# Altium project EPS.PrjPcb (part 1 of 4)
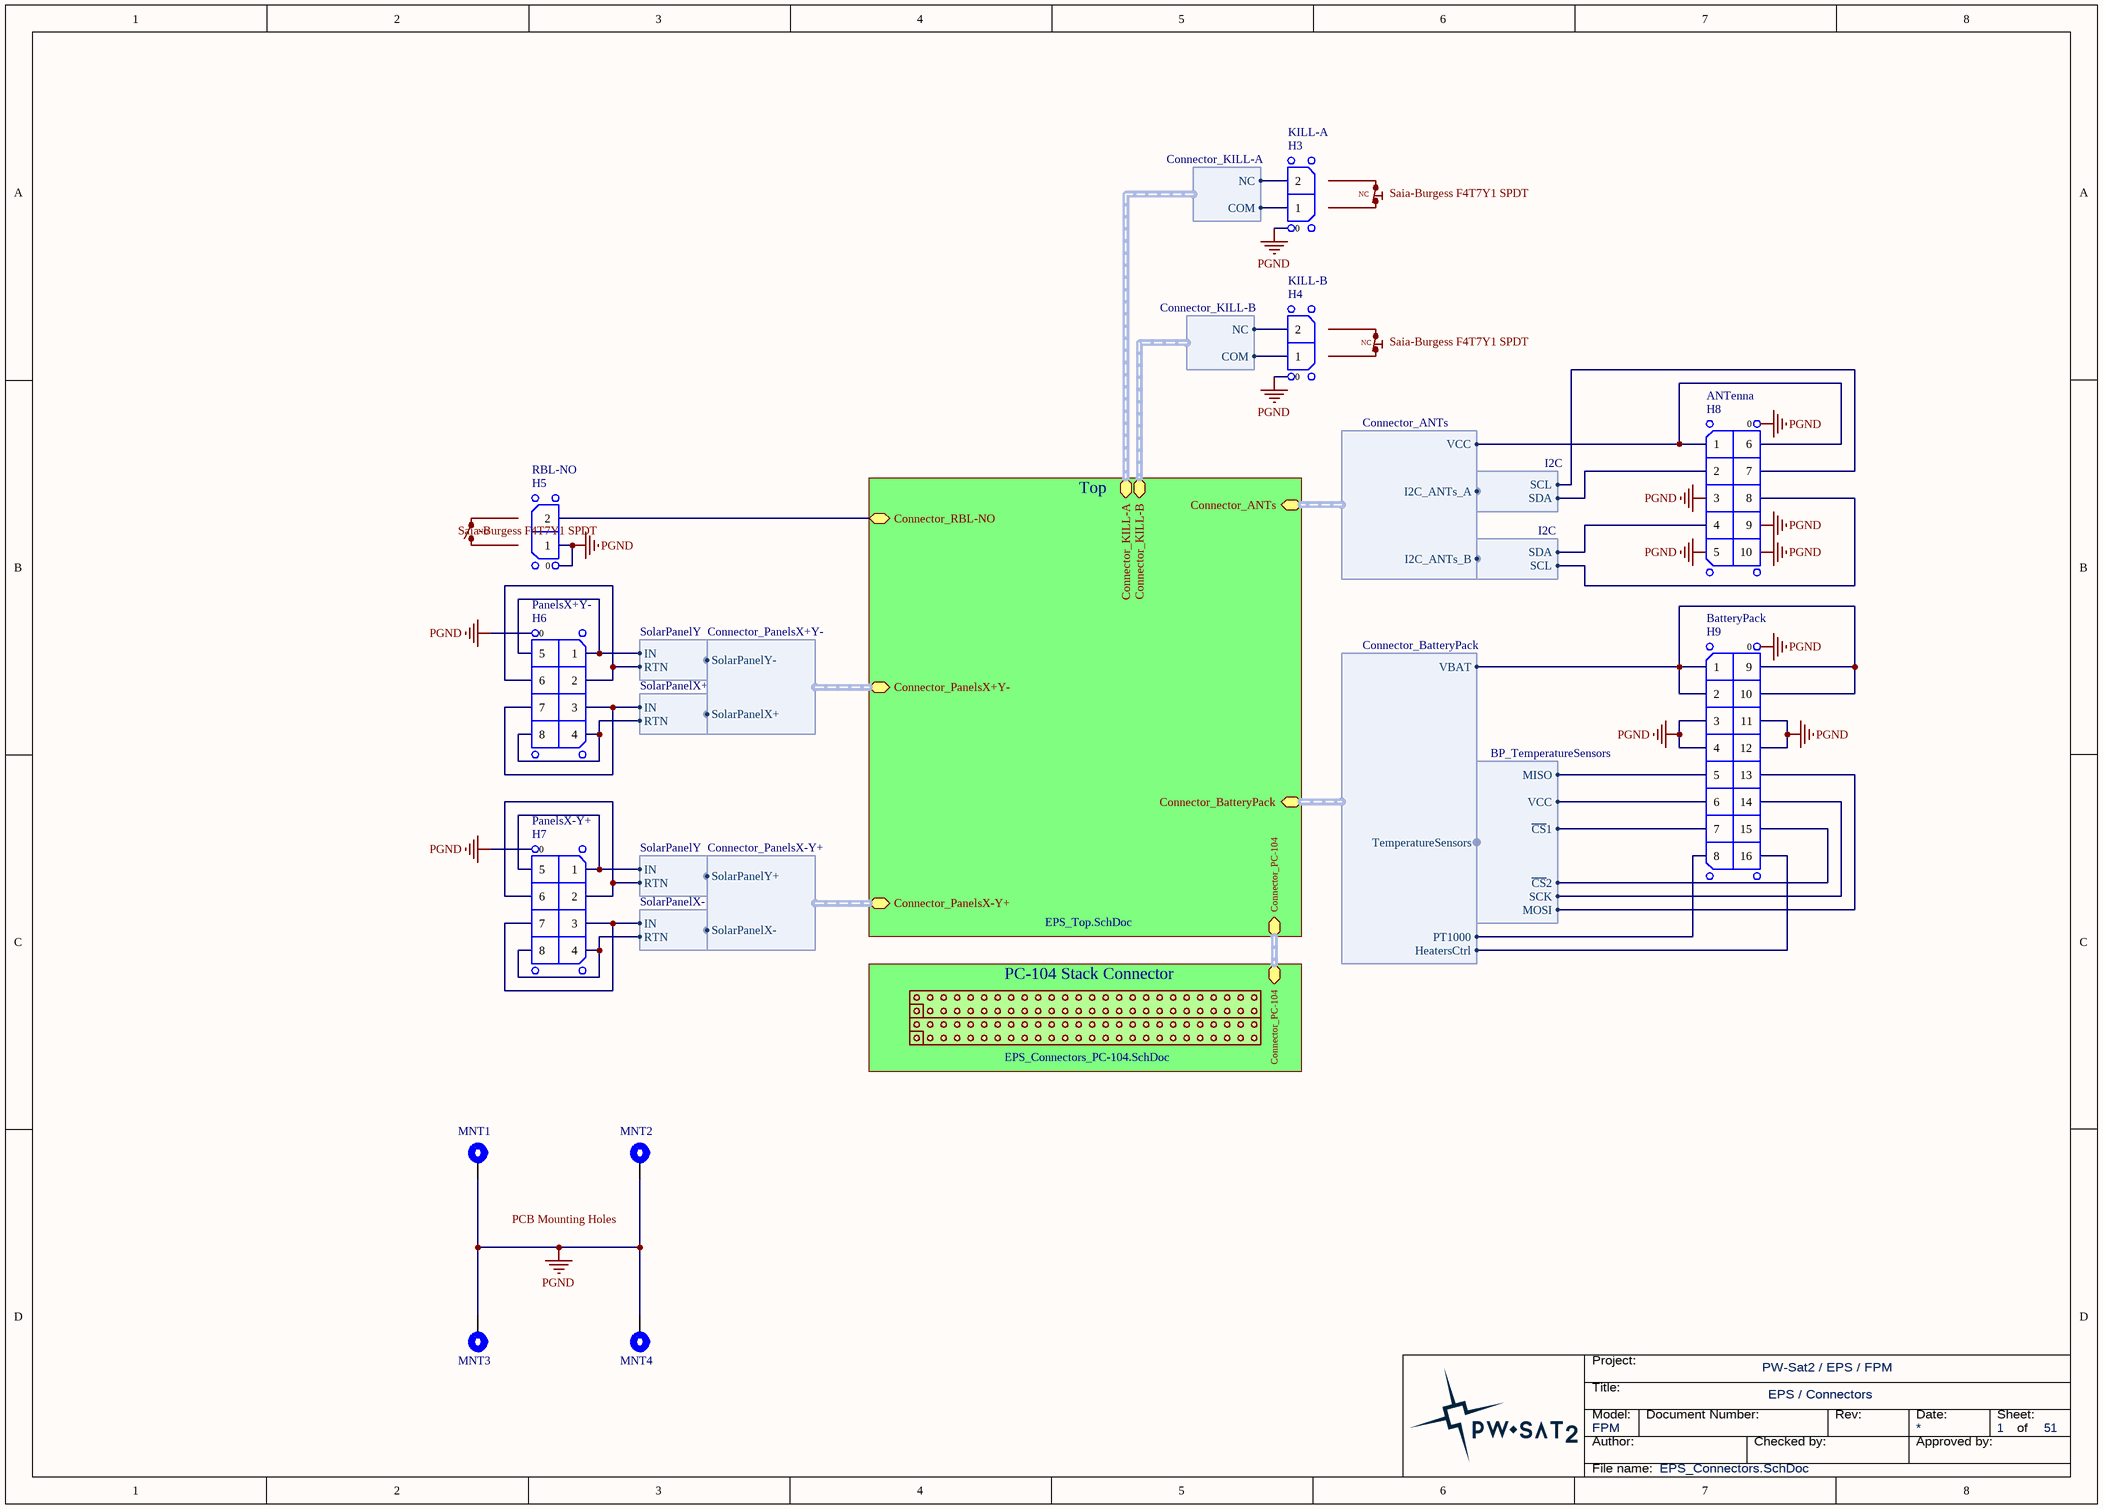
[diagram p0: EPS_Connectors.SchDoc]
ApprovedBy_Name: (not approved); Author_Name: Piotr Kuligowski; CheckedBy_Name: (not checked); Equipment: EPS; Model: FPM; PCB_Author: (pcbdoc author); PCB_CheckedBy: (not checked); PCB_DocName: EPS; PCB_DocNo: PWSat2-xxx-DW-xxx; PCB_Revision: 3; Project_FullName: PW-Sat2; Project_ShortName: PW-Sat2; Schematics_DocName: EPS; Schematics_DocNo: PWSat2-xxx-DW-xxx; Schematics_Revision: 3
40 sheets, 821 parts. Net scope: hierarchical (ports join the sheet entries above them; power ports are global).
Board file: EPS.PcbDoc
Sheets:
  EPS_Connectors.SchDoc
    Top = EPS_Top.SchDoc
      Controller A = EPS_CTRL_A.SchDoc
        I2C Repeater = EPS_I2C-Repeater.SchDoc
        CTRL-A_Supply = EPS_CTRL_AB_Supply.SchDoc
        Temperature-Sensor = EPS_Temperature-Sensor.SchDoc
      MPPT X = EPS_MPPT_X.SchDoc
        MPPTX Boost Converter = EPS_MPPT_X_Boost-Converter.SchDoc
        MPPTX Interface to uC = EPS_MPPT_XY_Interface.SchDoc
        MPPTX Measurements = EPS_MPPT_XY_Measurements.SchDoc
        MPPTX Input EMI Filter = EPS_MPPT_X_EMI-Filter_In.SchDoc
        MPPTX ORing to MPB = EPS_MPPT_X_OR_MPB.SchDoc
      MPPT Y+ = EPS_MPPT_Y.SchDoc
        MPPTY Buck-Boost Converter = EPS_MPPT_Y_Buck-Boost-Converter.SchDoc
        MPPTY EMI Filters for Solar Panels = EPS_MPPT_Y_EMI-Filter_Solar-Panels.SchDoc
        MPPTY Interface to uC = EPS_MPPT_XY_Interface.SchDoc
        MPPTY Measurements = EPS_MPPT_XY_Measurements.SchDoc
        MPPTY Input EMI Filter = EPS_MPPT_Y_EMI-Filter_In.SchDoc
        MPPTY Output EMI Filter = EPS_MPPT_Y_EMI-Filter_Out.SchDoc
        MPPTY ORing to MPB = EPS_MPPT_Y_OR_MPB.SchDoc
      3V3 = EPS_3V3.SchDoc
        Temperature-Sensor = EPS_Temperature-Sensor.SchDoc
      5V = EPS_5V.SchDoc
        5V Output EMI Fitler = EPS_5V_EMI-Filter_Out.SchDoc
        Temperature-Sensor = EPS_Temperature-Sensor.SchDoc
      RBL & Inrush Limit = EPS_RBL.SchDoc
      Distribution = EPS_Distribution.SchDoc
        LCL-FPF SunS 3V3 = EPS_Distribution_LCL-FPF.SchDoc
        LCL-FPF CAMnadir 3V3 = EPS_Distribution_LCL-FPF.SchDoc
        LCL-FPF CAMwing 3V3 = EPS_Distribution_LCL-FPF.SchDoc
        LCL-TK MAIN = EPS_Distribution_LCL-TK.SchDoc
        LCL-TK Redundant = EPS_Distribution_LCL-TK.SchDoc
        LCL-FPF SENS 5V = EPS_Distribution_LCL-FPF.SchDoc
        RLCL-FPF 5V = EPS_Distribution_RLCL-FPF.SchDoc
        5V Measurements = EPS_Distribution_Measurements.SchDoc
        3V3 Measurements = EPS_Distribution_Measurements.SchDoc
        VBAT Measurements = EPS_Distribution_Measurements.SchDoc
        LCL-FPF ANTs 5V = EPS_Distribution_LCL-FPF.SchDoc
        RLCL-FPF 3V3 = EPS_Distribution_RLCL-FPF.SchDoc
        LCL-FPF ANTs 5V = EPS_Distribution_LCL-FPF.SchDoc
      VBAT = EPS_VBAT.SchDoc
      LCLs for DCDC = EPS_DCDC_RLCLs.SchDoc
        DCDC RLCL = EPS_DCDC_RLCL-FPF.SchDoc
        VBAT RLCL = EPS_DCDC_RLCL-FPF.SchDoc
      Local-Supply and WDTs = EPS_Local-Supply.SchDoc
        Local-Supply CTRL-A = EPS_Local-Supply_Channel.SchDoc
          Temperature-Sensor = EPS_Temperature-Sensor.SchDoc
        Local-Supply CTRL-B = EPS_Local-Supply_Channel.SchDoc
          Temperature-Sensor = EPS_Temperature-Sensor.SchDoc
      Battery Pack = EPS_Battery.SchDoc
        Battery Controller = EPS_Battery_Controller.SchDoc
          Battery Current Meas. = EPS_Battery_Controller_Current-Meas.SchDoc
          Battery Voltage Meas. = EPS_Battery_Controller_Voltage-Meas.SchDoc
          Battery Charger - RLCL = EPS_Battery_Controller_RLCL.SchDoc
        Heaters Control = EPS_Battery_Heaters-Control.SchDoc
        Temperature-Sensor = EPS_Temperature-Sensor.SchDoc
      MPPT Y- = EPS_MPPT_Y.SchDoc
        MPPTY Buck-Boost Converter = EPS_MPPT_Y_Buck-Boost-Converter.SchDoc
        MPPTY EMI Filters for Solar Panels = EPS_MPPT_Y_EMI-Filter_Solar-Panels.SchDoc
        MPPTY Interface to uC = EPS_MPPT_XY_Interface.SchDoc
        MPPTY Measurements = EPS_MPPT_XY_Measurements.SchDoc
        MPPTY Input EMI Filter = EPS_MPPT_Y_EMI-Filter_In.SchDoc
        MPPTY Output EMI Filter = EPS_MPPT_Y_EMI-Filter_Out.SchDoc
        MPPTY ORing to MPB = EPS_MPPT_Y_OR_MPB.SchDoc
      Controller B = EPS_CTRL_B.SchDoc
        I2C Repeater = EPS_I2C-Repeater.SchDoc
        Temperature-Sensor = EPS_Temperature-Sensor.SchDoc
        CTRL-B_Supply = EPS_CTRL_AB_Supply.SchDoc
    PC-104 Stack Connector = EPS_Connectors_PC-104.SchDoc

## Sheet EPS_Connectors.SchDoc: Connectors
size A3; ApprovedBy: (not approved); CheckedBy: (not checked); Author: Piotr Kuligowski; DocumentNumber: PWSat2-xxx-DW-xxx; Revision: 3; SheetNumber: 1; SheetTotal: 51; Model: FPM

### Parts
H3  KILL-A  [Harwin_Datamate_L-Tek_M80-8770222]
H4  KILL-B  [Harwin_Datamate_L-Tek_M80-8770222]
H5  RBL-NO  [Harwin_Datamate_L-Tek_M80-8770222]
H6  PanelsX+Y-  [Harwin_Datamate_L-Tek_M80-8670805]
H7  PanelsX-Y+  [Harwin_Datamate_L-Tek_M80-8670805]
H8  ANTenna  [Harwin_Datamate_L-Tek_M80-8671005]
H9  BatteryPack  [Harwin_Datamate_L-Tek_M80-8531642]
MNT1  Mounting Hole  [PC-104_PcbMntHole_M3]  (value not drawn)
MNT2  Mounting Hole  [PC-104_PcbMntHole_M3]  (value not drawn)
MNT3  Mounting Hole  [PC-104_PcbMntHole_M3]  (value not drawn)
MNT4  Mounting Hole  [PC-104_PcbMntHole_M3]  (value not drawn)

### Sub-sheets
PC-104 Stack Connector = EPS_Connectors_PC-104.SchDoc: Connector_PC-104 (harness Connector_PC-104)
Top = EPS_Top.SchDoc: Connector_PC-104 (harness Connector_PC-104), Connector_KILL-B (harness Connector_KILL-B), Connector_KILL-A (harness Connector_KILL-A), Connector_PanelsX+Y- (harness Connector_PanelsX+Y-), Connector_PanelsX-Y+ (harness Connector_PanelsX-Y+), Connector_ANTs (harness Connector_ANTs), Connector_BatteryPack (harness Connector_BatteryPack), Connector_RBL-NO (bidir)

### Harnesses
SolarPanelX-: IN, RTN
SolarPanelY: IN, RTN
SolarPanelX+: IN, RTN
Connector_PanelsX-Y+: SolarPanelX-, SolarPanelY+
Connector_PanelsX+Y-: SolarPanelX+, SolarPanelY-
Connector_KILL-A: COM, NC
Connector_KILL-B: COM, NC
I2C: SDA, SCL
Connector_ANTs: I2C_ANTs_A, VCC, I2C_ANTs_B
Connector_BatteryPack: VBAT, TemperatureSensors, HeatersCtrl, PT1000
BP_TemperatureSensors: MISO, VCC, ~{CS}1, ~{CS}2, SCK, MOSI

### Nets
PGND: H3.0 H4.0 H5.0 H5.1 H6.0 H7.0 H8.0 H8.3 H8.5 H8.9 H8.10 H9.0 H9.3 H9.4 H9.11 H9.12 MNT1.1 MNT2.1 MNT3.1 MNT4.1
PC-104_I2C-Bus_SCL: H8.7 ; harness I2C.SCL
PC-104_I2C-Bus_SDA: H8.2 ; harness I2C.SDA
PC-104_I2C-Payload_SCL: H8.8 ; harness I2C.SCL
PC-104_I2C-Payload_SDA: H8.4 ; harness I2C.SDA
PC-104_Kill-Switch_Pri: H3.2 H4.2 ; sheet Top/Connector_KILL-A.NC, sheet Top/Connector_KILL-B.NC
PC-104_Kill-Switch_Sec: H3.1 H4.1 ; sheet Top/Connector_KILL-A.COM, sheet Top/Connector_KILL-B.COM
NetBATV_R1_1: H9.1 H9.2 H9.9 H9.10 ; sheet Top/Connector_BatteryPack.VBAT
NetCTRLA_J3_1: H9.6 ; harness BP_TemperatureSensors.VCC
NetCTRLA_R16_1: H9.7 ; harness BP_TemperatureSensors.~{CS}1
NetCTRLA_R16_2: H9.15 ; harness BP_TemperatureSensors.~{CS}2
NetCTRLA_R16_3: H9.5 ; harness BP_TemperatureSensors.MISO
NetCTRLA_R16_4: H9.13 ; harness BP_TemperatureSensors.MOSI
NetCTRLA_R17_2: H9.14 ; harness BP_TemperatureSensors.SCK
NetCTRLB_C5_1: H9.8 ; sheet Top/Connector_BatteryPack.PT1000
NetEMIYS_T1_1_1: H7.1 H7.5 ; harness SolarPanelY.IN
NetEMIYS_T1_1_2: H7.2 H7.6 ; harness SolarPanelY.RTN
NetEMIYS_T1_2_1: H6.1 H6.5 ; harness SolarPanelY.IN
NetEMIYS_T1_2_2: H6.2 H6.6 ; harness SolarPanelY.RTN
NetH5_2: H5.2 ; sheet Top/Connector_RBL-NO
NetH6_3: H6.3 H6.7 ; harness SolarPanelX+.IN
NetH6_4: H6.4 H6.8 ; harness SolarPanelX+.RTN
NetH7_3: H7.3 H7.7 ; harness SolarPanelX-.IN
NetH7_4: H7.4 H7.8 ; harness SolarPanelX-.RTN
NetH8_1: H8.1 H8.6 ; sheet Top/Connector_ANTs.VCC
NetH9_16: H9.16 ; sheet Top/Connector_BatteryPack.HeatersCtrl

### Buses and harness runs
harness sheet PC-104 Stack Connector/Connector_PC-104 = sheet Top/Connector_PC-104

### Notes on the sheet
- NC
- Saia-Burgess F4T7Y1 SPDT
- NO
- PCB Mounting Holes
- Title:
- Project:
- Author:
- Model:
- Document Number:
- Checked by:
- Rev:
- Date:
- Approved by:
- Sheet:
- of
- File name:

### Library data of the parts
H3-H5 = Harwin_Datamate_L-Tek_1x2pin: Harwin DataMate L-Tek, 2mm pitch, 1x2pin.; Value: Harwin DataMate L-Tek 1x2pin
H6 H7 = Harwin_Datamate_L-Tek_2x4pin: Harwin DataMate L-Tek, 2mm pitch, 2x4pin.; Value: Harwin DataMate L-Tek 2x4pin
H8 = Harwin_Datamate_L-Tek_2x5pin: Harwin DataMate L-Tek, 2mm pitch, 2x5pin.; Value: Harwin DataMate L-Tek 2x5pin
H9 = Harwin_Datamate_L-Tek_2x8pin: Harwin DataMate L-Tek, 2mm pitch, 2x8pin.; Value: Harwin DataMate L-Tek 2x8pin
MNT1-MNT4 = MntHole: PCB Mounting Hole; Value: Mounting Hole

## Sheet EPS_Top.SchDoc: Top
size A3; ApprovedBy: (not approved); CheckedBy: (not checked); Author: Piotr Kuligowski; DocumentNumber: PWSat2-xxx-DW-xxx; Revision: 3; SheetNumber: 3; SheetTotal: 51; Model: FPM
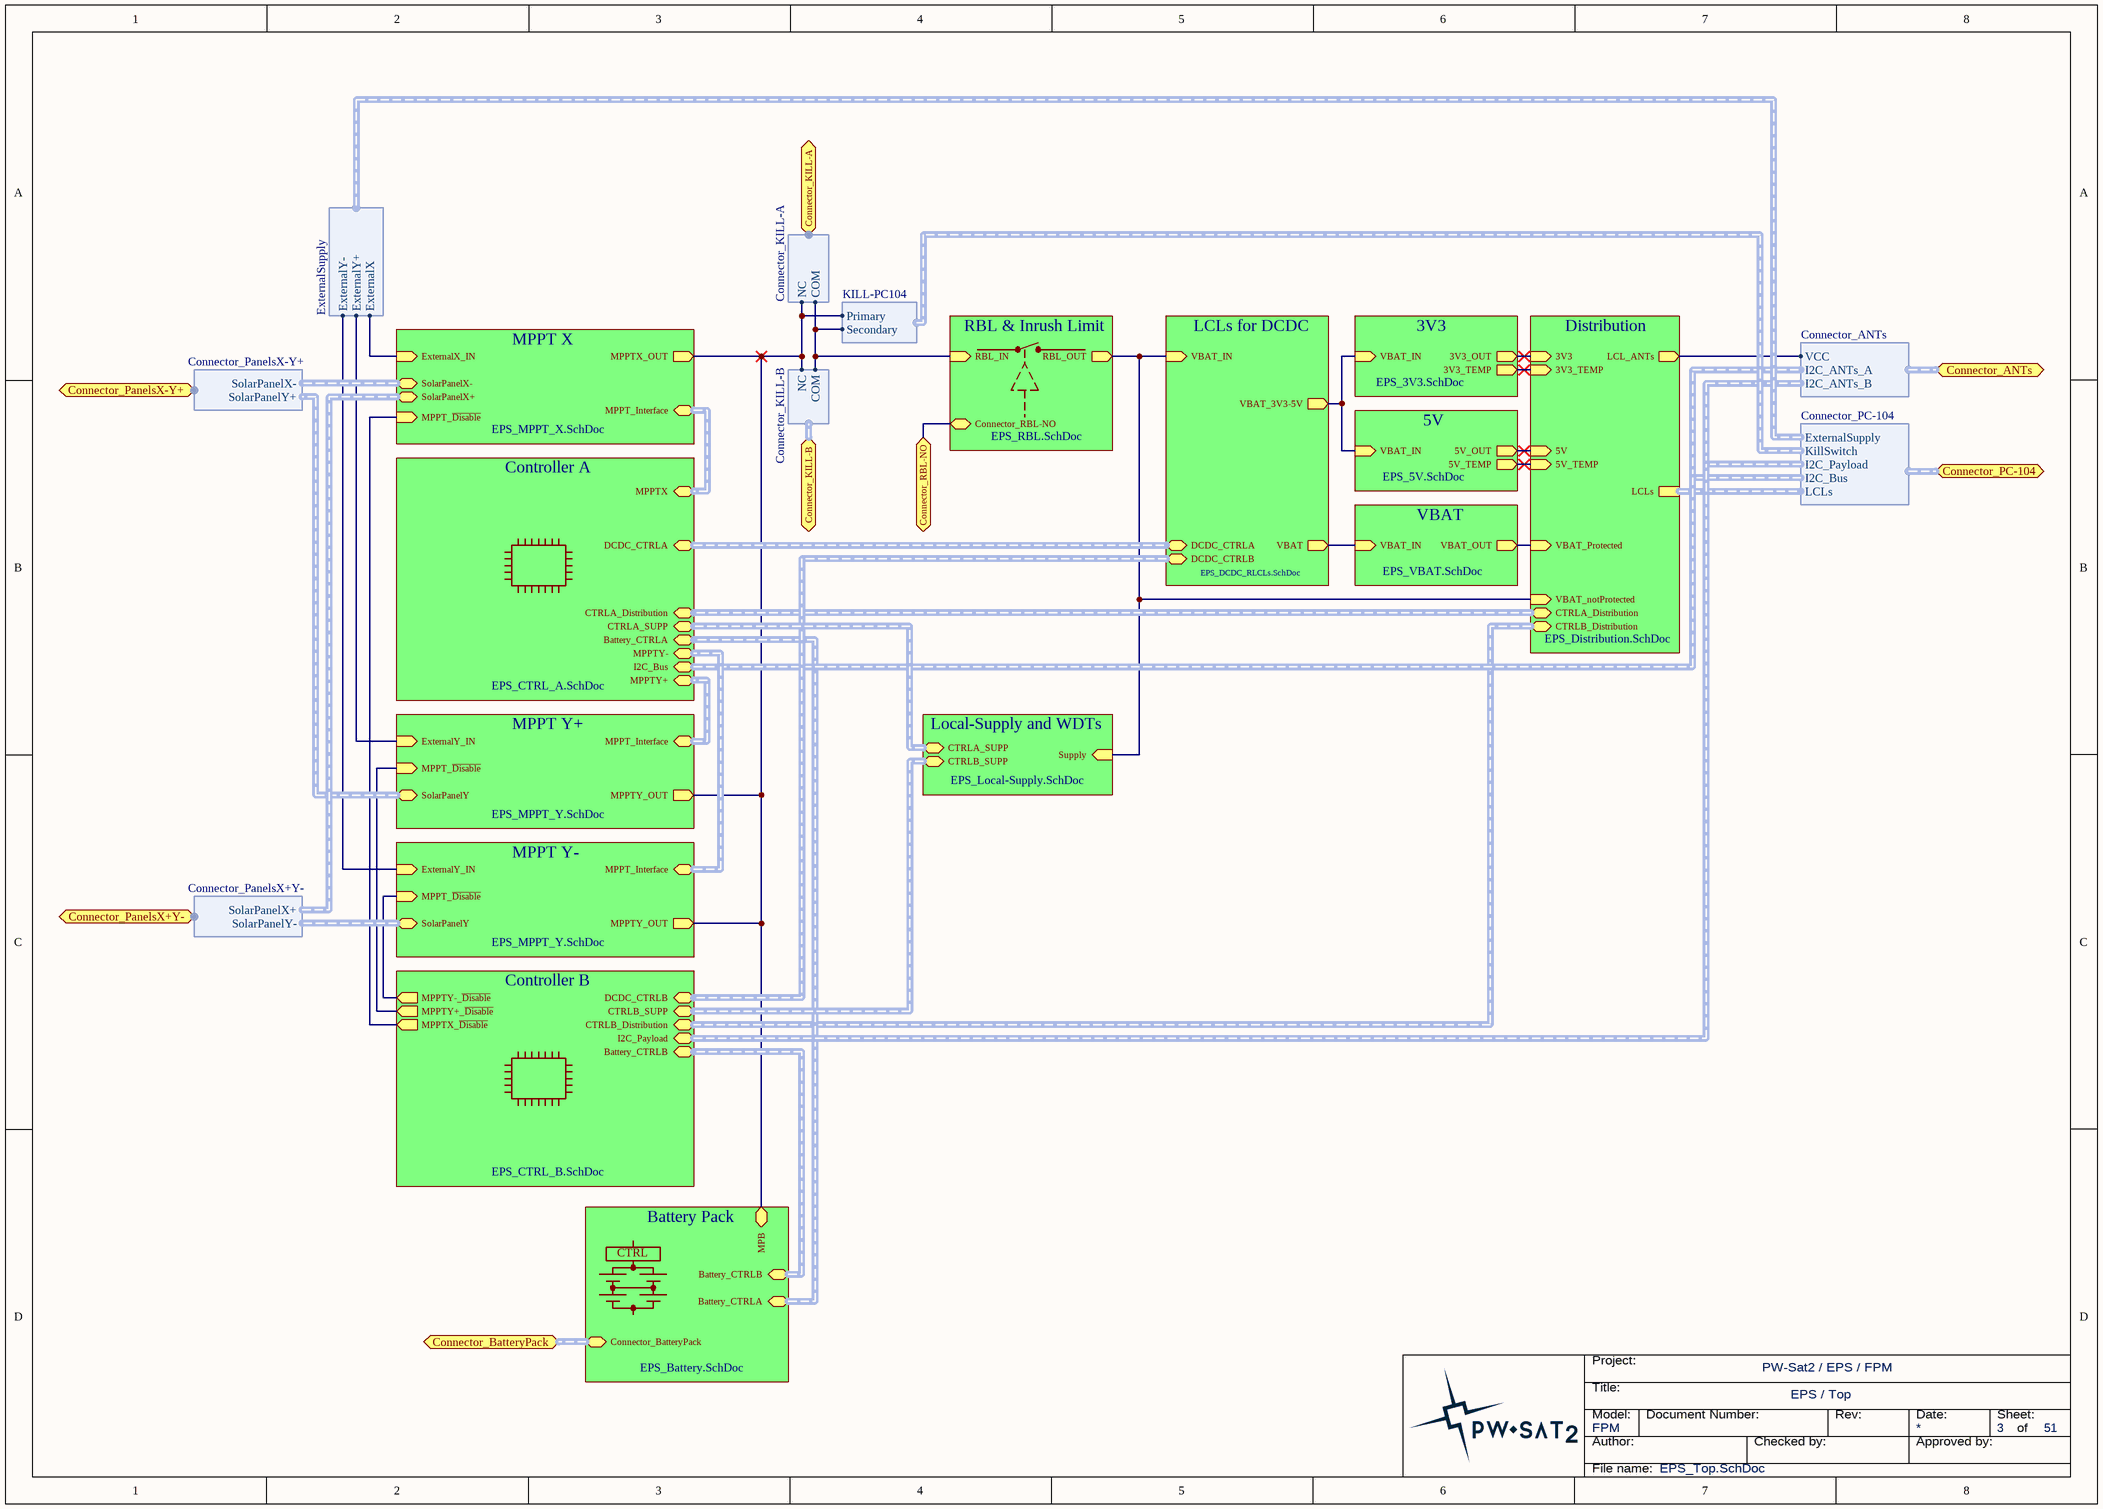
[diagram p1: EPS_Top.SchDoc]

### Sub-sheets
3V3 = EPS_3V3.SchDoc: 3V3_OUT (out), VBAT_IN (in), 3V3_TEMP (out)
5V = EPS_5V.SchDoc: 5V_OUT (out), VBAT_IN (in), 5V_TEMP (out)
Battery Pack = EPS_Battery.SchDoc: MPB (bidir), Connector_BatteryPack (harness Connector_BatteryPack), Battery_CTRLA (harness Battery_CTRLA), Battery_CTRLB (harness Battery_CTRLB)
Controller A = EPS_CTRL_A.SchDoc: CTRLA_Distribution (harness CTRLA_Distribution), Battery_CTRLA (harness Battery_CTRLA), I2C_Bus (harness I2C), MPPTX (harness MPPT_Interface), DCDC_CTRLA (harness DCDC_CTRLA), CTRLA_SUPP (harness CTRLA_SUPP), MPPTY+ (harness MPPT_Interface), MPPTY- (harness MPPT_Interface)
Controller B = EPS_CTRL_B.SchDoc: Battery_CTRLB (harness Battery_CTRLB), I2C_Payload (harness I2C), CTRLB_Distribution (harness CTRLB_Distribution), DCDC_CTRLB (harness DCDC_CTRLB), CTRLB_SUPP (harness CTRLB_SUPP), MPPTY-_~{Disable} (out), MPPTX_~{Disable} (out), MPPTY+_~{Disable} (out)
Distribution = EPS_Distribution.SchDoc: 3V3 (in), 5V (in), LCLs (harness LCLs), CTRLB_Distribution (harness CTRLB_Distribution), CTRLA_Distribution (harness CTRLA_Distribution), VBAT_notProtected (in), VBAT_Protected (in), LCL_ANTs (out), 3V3_TEMP (in), 5V_TEMP (in)
LCLs for DCDC = EPS_DCDC_RLCLs.SchDoc: VBAT_IN (in), VBAT_3V3-5V (out), VBAT (out), DCDC_CTRLB (harness DCDC_CTRLB), DCDC_CTRLA (harness DCDC_CTRLA)
Local-Supply and WDTs = EPS_Local-Supply.SchDoc: Supply (in), CTRLA_SUPP (harness CTRLA_SUPP), CTRLB_SUPP (harness CTRLB_SUPP)
MPPT X = EPS_MPPT_X.SchDoc: ExternalX_IN (in), SolarPanelX- (harness SolarPanelX-), SolarPanelX+ (harness SolarPanelX+), MPPTX_OUT (out), MPPT_Interface (harness MPPT_Interface), MPPT_~{Disable} (in)
MPPT Y+ = EPS_MPPT_Y.SchDoc: ExternalY_IN (in), SolarPanelY (harness SolarPanelY), MPPTY_OUT (out), MPPT_Interface (harness MPPT_Interface), MPPT_~{Disable} (in)
MPPT Y- = EPS_MPPT_Y.SchDoc: ExternalY_IN (in), SolarPanelY (harness SolarPanelY), MPPTY_OUT (out), MPPT_Interface (harness MPPT_Interface), MPPT_~{Disable} (in)
RBL & Inrush Limit = EPS_RBL.SchDoc: RBL_OUT (out), RBL_IN (in), Connector_RBL-NO (bidir)
VBAT = EPS_VBAT.SchDoc: VBAT_OUT (out), VBAT_IN (in)

### Ports
Connector_ANTs (harness Connector_ANTs), Connector_BatteryPack (harness Connector_BatteryPack), Connector_KILL-A (harness Connector_KILL-A), Connector_KILL-B (harness Connector_KILL-B), Connector_PanelsX+Y- (harness Connector_PanelsX+Y-), Connector_PanelsX-Y+ (harness Connector_PanelsX-Y+), Connector_PC-104 (harness Connector_PC-104), Connector_RBL-NO (bidir)

### Harnesses
Connector_KILL-A: COM, NC
Connector_KILL-B: COM, NC
Connector_PC-104: I2C_Payload, LCLs, I2C_Bus, ExternalSupply, KillSwitch
Connector_PanelsX-Y+: SolarPanelX-, SolarPanelY+
Connector_PanelsX+Y-: SolarPanelX+, SolarPanelY-
Connector_ANTs: I2C_ANTs_A, VCC, I2C_ANTs_B
ExternalSupply: ExternalX, ExternalY-, ExternalY+
KILL-PC104: Secondary, Primary

### Nets
CTRLA_HK_3V3_TEMP: sheet 3V3/3V3_TEMP, sheet Distribution/3V3_TEMP
CTRLA_HK_5V_TEMP: sheet 5V/5V_TEMP, sheet Distribution/5V_TEMP
PC-104_EXTX: sheet MPPT X/ExternalX_IN, harness ExternalSupply.ExternalX
PC-104_EXTY+: sheet MPPT Y+/ExternalY_IN, harness ExternalSupply.ExternalY+
PC-104_EXTY-: sheet MPPT Y-/ExternalY_IN, harness ExternalSupply.ExternalY-
PC-104_Kill-Switch_Pri: sheet MPPT X/MPPTX_OUT, sheet MPPT Y+/MPPTY_OUT, sheet Battery Pack/MPB, sheet MPPT Y-/MPPTY_OUT, port Connector_KILL-A.NC, port Connector_KILL-B.NC, harness KILL-PC104.Primary
PC-104_Kill-Switch_Sec: sheet RBL & Inrush Limit/RBL_IN, port Connector_KILL-A.COM, port Connector_KILL-B.COM, harness KILL-PC104.Secondary
NetCTRLB_U1_1: sheet MPPT X/MPPT_~{Disable}, sheet Controller B/MPPTX_~{Disable}
NetCTRLB_U1_2: sheet MPPT Y+/MPPT_~{Disable}, sheet Controller B/MPPTY+_~{Disable}
NetCTRLB_U1_3: sheet MPPT Y-/MPPT_~{Disable}, sheet Controller B/MPPTY-_~{Disable}
NetDRLCL_C1_1_1: sheet RBL & Inrush Limit/RBL_OUT, sheet Distribution/VBAT_notProtected, sheet LCLs for DCDC/VBAT_IN, sheet Local-Supply and WDTs/Supply
NetDRLCL_C4_1_1: sheet 3V3/VBAT_IN, sheet 5V/VBAT_IN, sheet LCLs for DCDC/VBAT_3V3-5V
NetDRLCL_C4_2_1: sheet VBAT/VBAT_IN, sheet LCLs for DCDC/VBAT
NetEMIBB_C1_1: sheet 5V/5V_OUT, sheet Distribution/5V
NetH5_2: port Connector_RBL-NO, sheet RBL & Inrush Limit/Connector_RBL-NO
NetH8_1: sheet Distribution/LCL_ANTs, port Connector_ANTs.VCC
NetHK_R1_2_4: sheet 3V3/3V3_OUT, sheet Distribution/3V3
NetHK_R1_3_4: sheet Distribution/VBAT_Protected, sheet VBAT/VBAT_OUT

### Buses and harness runs
harness port Connector_BatteryPack = sheet Battery Pack/Connector_BatteryPack
harness sheet Battery Pack/Battery_CTRLA = sheet Controller A/Battery_CTRLA
harness sheet Battery Pack/Battery_CTRLB = sheet Controller B/Battery_CTRLB
harness sheet Controller A/CTRLA_Distribution = sheet Distribution/CTRLA_Distribution
harness sheet Controller A/CTRLA_SUPP = sheet Local-Supply and WDTs/CTRLA_SUPP
harness sheet Controller A/DCDC_CTRLA = sheet LCLs for DCDC/DCDC_CTRLA
harness sheet Controller A/MPPTX = sheet MPPT X/MPPT_Interface
harness sheet Controller A/MPPTY+ = sheet MPPT Y+/MPPT_Interface
harness sheet Controller A/MPPTY- = sheet MPPT Y-/MPPT_Interface
harness sheet Controller B/CTRLB_Distribution = sheet Distribution/CTRLB_Distribution
harness sheet Controller B/CTRLB_SUPP = sheet Local-Supply and WDTs/CTRLB_SUPP
harness sheet Controller B/DCDC_CTRLB = sheet LCLs for DCDC/DCDC_CTRLB

### Notes on the sheet
- CTRL
- Title:
- Project:
- Author:
- Model:
- Document Number:
- Checked by:
- Rev:
- Date:
- Approved by:
- Sheet:
- of
- File name:

## Sheet EPS_CTRL_A.SchDoc: CTRL-A
size A3; ApprovedBy: (not approved); CheckedBy: (not checked); Author: Piotr Kuligowski; DocumentNumber: PWSat2-xxx-DW-xxx; Revision: 3; SheetNumber: 13; SheetTotal: 51; Model: FPM
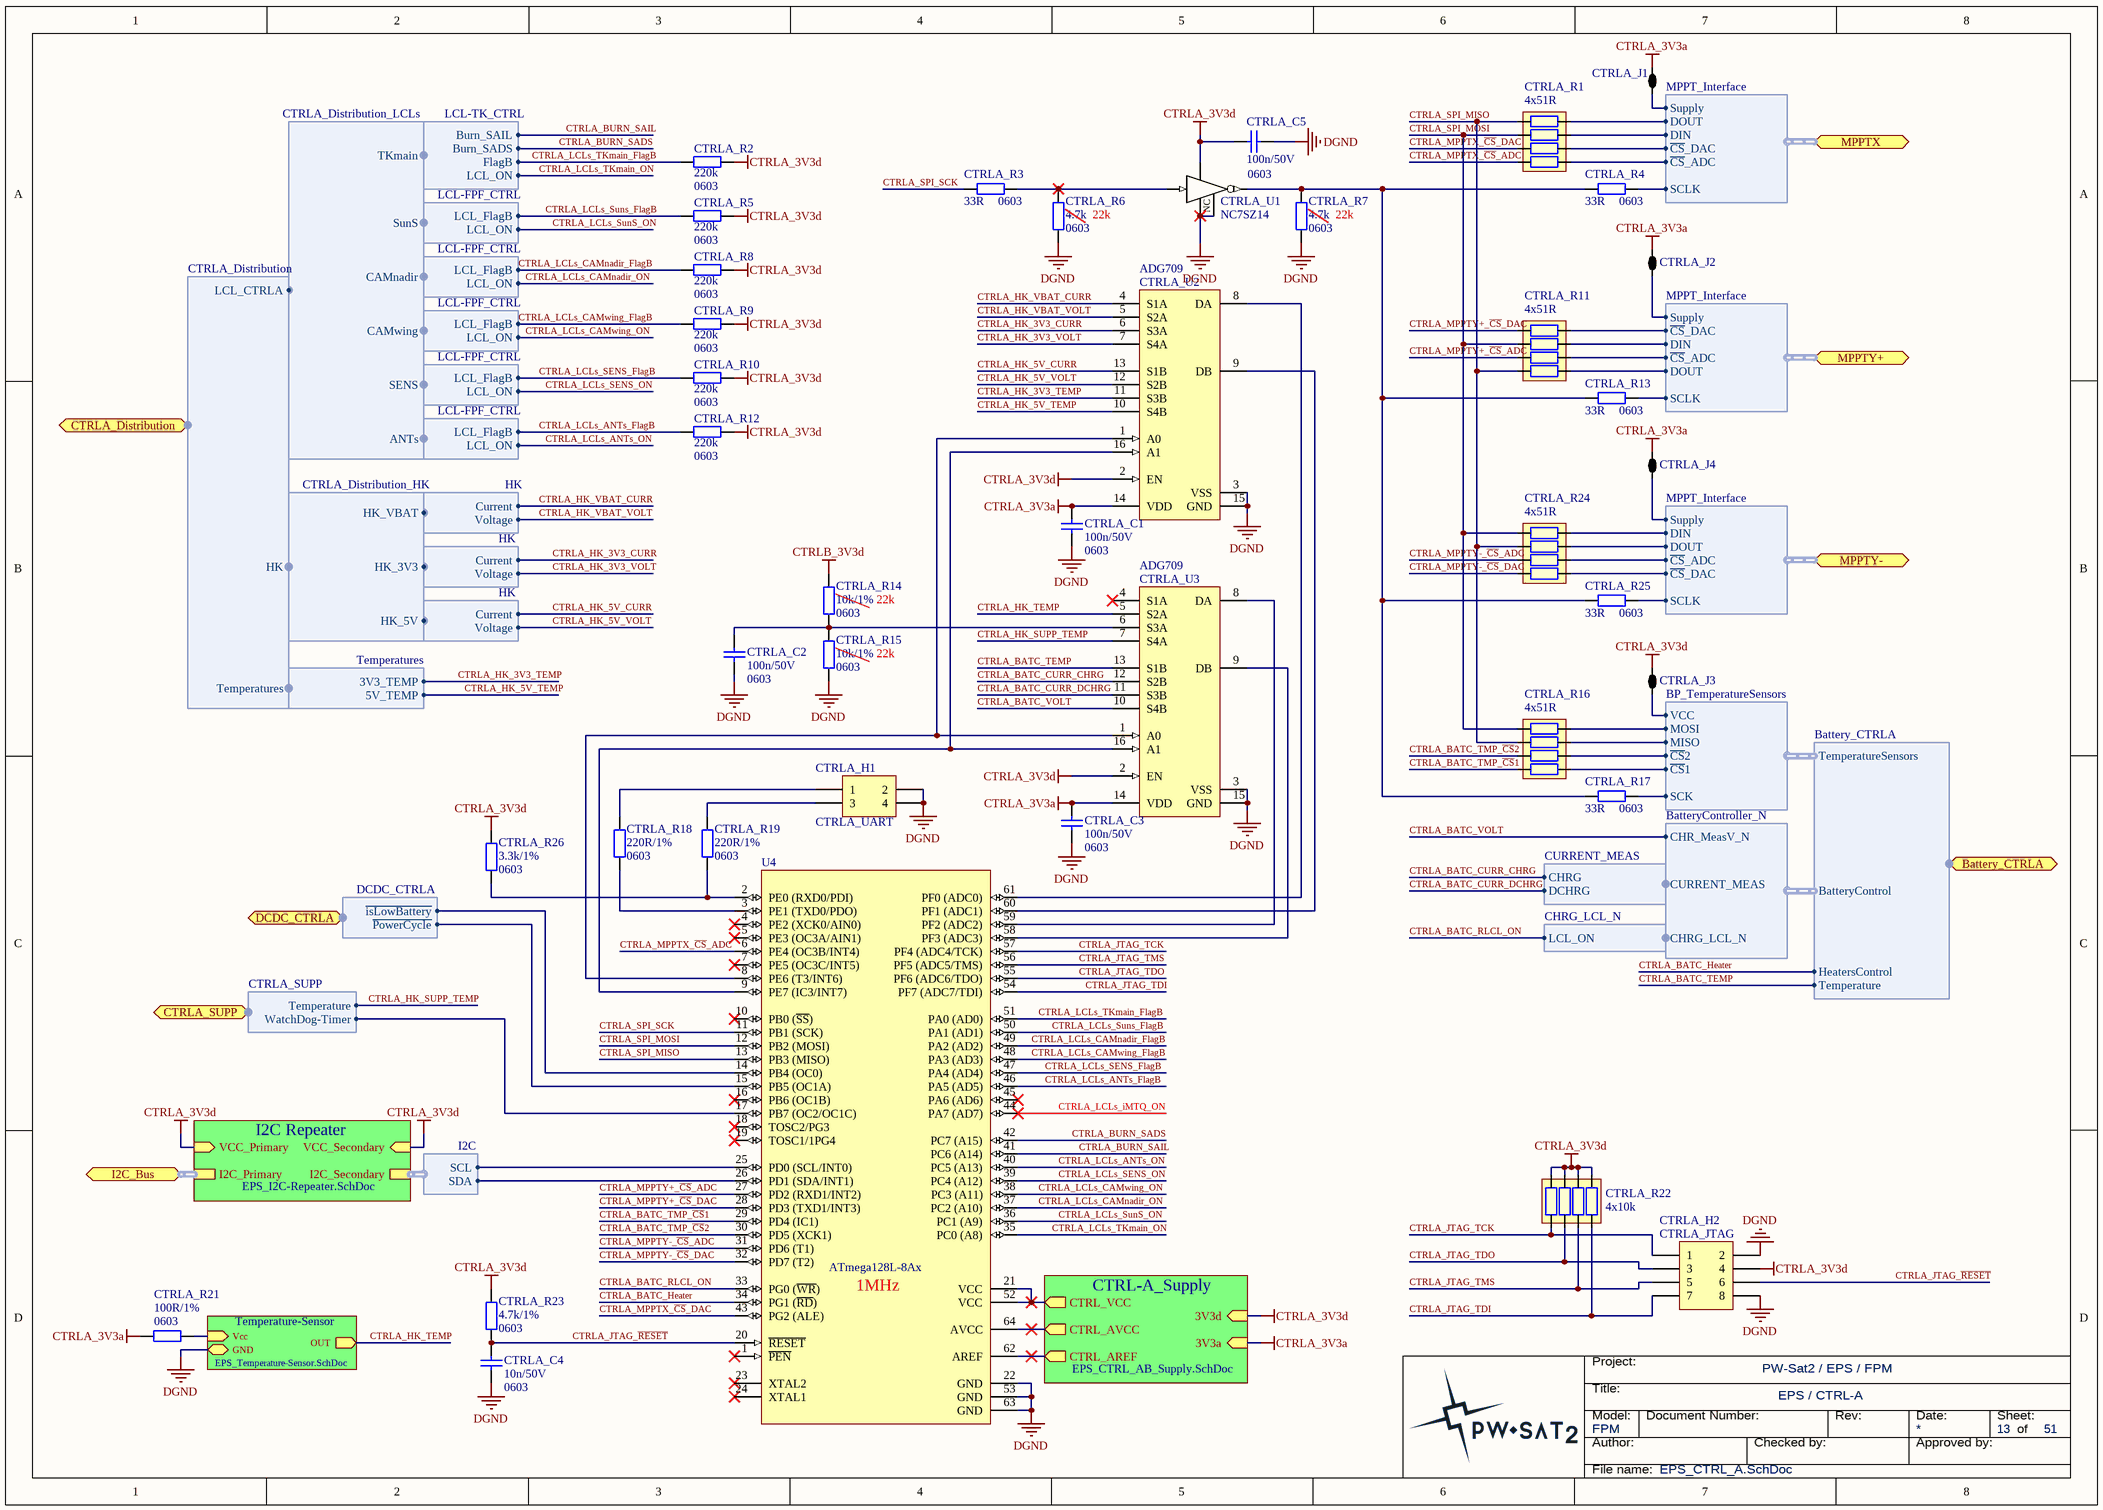
[diagram p2: EPS_CTRL_A.SchDoc]

### Parts
CTRLA_C1  Package: 0603  [SMD_Capacitor_0603]  (hidden comment: 100n/50V)
CTRLA_C2  Package: 0603  [SMD_Capacitor_0603]  (hidden comment: 100n/50V)
CTRLA_C3  Package: 0603  [SMD_Capacitor_0603]  (hidden comment: 100n/50V)
CTRLA_C4  Package: 0603  [SMD_Capacitor_0603]  (hidden comment: 10n/50V)
CTRLA_C5  Package: 0603  [SMD_Capacitor_0603]  (hidden comment: 100n/50V)
CTRLA_H1  CTRLA_UART  [Connfly_DS1031-04-2]
CTRLA_H2  CTRLA_JTAG  [Connfly_DS1031-08-2]
CTRLA_J1  2 way net tie junction  [2way_LP]  (value not drawn)  (net tie, no BOM)
CTRLA_J2  2 way net tie junction  [2way_LP]  (value not drawn)  (net tie, no BOM)
CTRLA_J3  2 way net tie junction  [2way_LP]  (value not drawn)  (net tie, no BOM)
CTRLA_J4  2 way net tie junction  [2way_LP]  (value not drawn)  (net tie, no BOM)
CTRLA_R1  4x51R  [SMD_RESISTOR_ARRAY_YC124]
CTRLA_R2  Package: 0603  [SMD_Resistor_0603]  (hidden comment: 220k)
CTRLA_R3  Package: 0603  [SMD_Resistor_0603]  (hidden comment: 33R)
CTRLA_R4  Package: 0603  [SMD_Resistor_0603]  (hidden comment: 33R)
CTRLA_R5  Package: 0603  [SMD_Resistor_0603]  (hidden comment: 220k)
CTRLA_R6  Package: 0603  [SMD_Resistor_0603]  (hidden comment: 4.7k)
CTRLA_R7  Package: 0603  [SMD_Resistor_0603]  (hidden comment: 4.7k)
CTRLA_R8  Package: 0603  [SMD_Resistor_0603]  (hidden comment: 220k)
CTRLA_R9  Package: 0603  [SMD_Resistor_0603]  (hidden comment: 220k)
CTRLA_R10  Package: 0603  [SMD_Resistor_0603]  (hidden comment: 220k)
CTRLA_R11  4x51R  [SMD_RESISTOR_ARRAY_YC124]
CTRLA_R12  Package: 0603  [SMD_Resistor_0603]  (hidden comment: 220k)
CTRLA_R13  Package: 0603  [SMD_Resistor_0603]  (hidden comment: 33R)
CTRLA_R14  Package: 0603  [SMD_Resistor_0603]  (hidden comment: 10k/1%)
CTRLA_R15  Package: 0603  [SMD_Resistor_0603]  (hidden comment: 10k/1%)
CTRLA_R16  4x51R  [SMD_RESISTOR_ARRAY_YC124]
CTRLA_R17  Package: 0603  [SMD_Resistor_0603]  (hidden comment: 33R)
CTRLA_R18  Package: 0603  [SMD_Resistor_0603]  (hidden comment: 220R/1%)
CTRLA_R19  Package: 0603  [SMD_Resistor_0603]  (hidden comment: 220R/1%)
CTRLA_R21  Package: 0603  [SMD_Resistor_0603]  (hidden comment: 100R/1%)
CTRLA_R22  4x10k  [SMD_RESISTOR_ARRAY_YC124]
CTRLA_R23  Package: 0603  [SMD_Resistor_0603]  (hidden comment: 4.7k/1%)
CTRLA_R24  4x51R  [SMD_RESISTOR_ARRAY_YC124]
CTRLA_R25  Package: 0603  [SMD_Resistor_0603]  (hidden comment: 33R)
CTRLA_R26  Package: 0603  [SMD_Resistor_0603]  (hidden comment: 3.3k/1%)
CTRLA_U1  NC7SZ14  [SOT23-5]
CTRLA_U2  ADG709  [TSSOP16]
CTRLA_U3  ADG709  [TSSOP16]
U4  ATmega128L-8Ax  [64A_N]

### Sub-sheets
CTRL-A_Supply = EPS_CTRL_AB_Supply.SchDoc: CTRL_VCC (out), CTRL_AVCC (out), CTRL_AREF (out), 3V3d (in), 3V3a (in)
I2C Repeater = EPS_I2C-Repeater.SchDoc: I2C_Primary (harness I2C), I2C_Secondary (harness I2C), VCC_Secondary (in), VCC_Primary (in)
Temperature-Sensor = EPS_Temperature-Sensor.SchDoc: OUT (out), Vcc (in), GND

### Ports
Battery_CTRLA (harness Battery_CTRLA), CTRLA_Distribution (harness CTRLA_Distribution), CTRLA_SUPP (harness CTRLA_SUPP), DCDC_CTRLA (harness DCDC_CTRLA), I2C_Bus (harness I2C), MPPTX (harness MPPT_Interface), MPPTY+ (harness MPPT_Interface), MPPTY- (harness MPPT_Interface)

### Harnesses
I2C: SDA, SCL
MPPT_Interface: DIN, DOUT, SCLK, ~{CS}_DAC, ~{CS}_ADC, Supply
Battery_CTRLA: BatteryControl, HeatersControl, TemperatureSensors, Temperature
BatteryController_N: CHRG_LCL_N, CURRENT_MEAS, CHR_MeasV_N
CURRENT_MEAS: CHRG, DCHRG
CHRG_LCL_N: LCL_ON
BP_TemperatureSensors: MISO, VCC, ~{CS}1, ~{CS}2, SCK, MOSI
CTRLA_Distribution_LCLs: TKmain, SunS, CAMnadir, CAMwing, SENS, ANTs
CTRLA_Distribution: LCL_CTRLA, HK, Temperatures
HK: Voltage, Current
CTRLA_Distribution_HK: HK_VBAT, HK_3V3, HK_5V
LCL-FPF_CTRL: LCL_FlagB, LCL_ON
LCL-TK_CTRL: FlagB, LCL_ON, Burn_SAIL, Burn_SADS
Temperatures: 3V3_TEMP, 5V_TEMP
DCDC_CTRLA: ~{PowerCycle}, ~{isLowBattery}
CTRLA_SUPP: Temperature, WatchDog-Timer

### Nets
CTRLA_3V3a: CTRLA_C1.1 CTRLA_C3.1 CTRLA_J1.2 CTRLA_J2.2 CTRLA_J4.2 CTRLA_R21.2 CTRLA_U2.14(VDD) CTRLA_U3.14(VDD) ; sheet CTRL-A_Supply/3V3a
CTRLA_3V3d: CTRLA_C5.1 CTRLA_H2.4 CTRLA_J3.2 CTRLA_R2.1 CTRLA_R5.1 CTRLA_R8.1 CTRLA_R9.1 CTRLA_R10.1 CTRLA_R12.1 CTRLA_R22.1 CTRLA_R22.2 CTRLA_R22.3 CTRLA_R22.4 CTRLA_R23.2 CTRLA_R26.2 CTRLA_U1.5(Vcc) CTRLA_U2.2(EN) CTRLA_U3.2(EN) U4.21(VCC) U4.52(VCC) ; sheet I2C Repeater/VCC_Secondary, sheet I2C Repeater/VCC_Primary, sheet CTRL-A_Supply/CTRL_VCC, sheet CTRL-A_Supply/3V3d
CTRLB_3V3d: CTRLA_R14.2
DGND: CTRLA_C1.2 CTRLA_C2.2 CTRLA_C3.2 CTRLA_C4.2 CTRLA_C5.2 CTRLA_H1.2 CTRLA_H1.4 CTRLA_H2.2 CTRLA_H2.8 CTRLA_R6.1 CTRLA_R7.1 CTRLA_R15.1 CTRLA_U1.1(NC) CTRLA_U1.3(GND) CTRLA_U2.3(VSS) CTRLA_U2.15(GND) CTRLA_U3.3(VSS) CTRLA_U3.15(GND) U4.22(GND) U4.53(GND) U4.63(GND) ; sheet Temperature-Sensor/GND
CTRLA_BATC_CURR_CHRG: CTRLA_U3.12(S2B) ; harness CURRENT_MEAS.CHRG  [project net CHRG_MEAS_CURRENT]
CTRLA_BATC_CURR_DCHRG: CTRLA_U3.11(S3B) ; harness CURRENT_MEAS.DCHRG
CTRLA_BATC_Heater: U4.34(PG1_(~{RD})) ; port Battery_CTRLA.HeatersControl
CTRLA_BATC_RLCL_ON: U4.33(PG0_(~{WR})) ; harness CHRG_LCL_N.LCL_ON  [project net CHRG_LCLN_ON]
CTRLA_BATC_TEMP: CTRLA_U3.13(S1B) ; port Battery_CTRLA.Temperature
CTRLA_BATC_TMP_~{CS}1: CTRLA_R16.8 U4.29(PD4_(IC1))
CTRLA_BATC_TMP_~{CS}2: CTRLA_R16.7 U4.30(PD5_(XCK1))
CTRLA_BATC_VOLT: CTRLA_U3.10(S4B) ; harness BatteryController_N.CHR_MeasV_N  [project net BAT_MEAS_VOLTAGE_N]
CTRLA_BURN_SADS: U4.42(PC7_(A15)) ; harness LCL-TK_CTRL.Burn_SADS
CTRLA_BURN_SAIL: U4.41(PC6_(A14)) ; harness LCL-TK_CTRL.Burn_SAIL
CTRLA_HK_3V3_CURR: CTRLA_U2.6(S3A) ; harness HK.Current
CTRLA_HK_3V3_TEMP: CTRLA_U2.11(S3B) ; harness Temperatures.3V3_TEMP
CTRLA_HK_3V3_VOLT: CTRLA_U2.7(S4A) ; harness HK.Voltage
CTRLA_HK_5V_CURR: CTRLA_U2.13(S1B) ; harness HK.Current
CTRLA_HK_5V_TEMP: CTRLA_U2.10(S4B) ; harness Temperatures.5V_TEMP
CTRLA_HK_5V_VOLT: CTRLA_U2.12(S2B) ; harness HK.Voltage
CTRLA_HK_SUPP_TEMP: CTRLA_U3.7(S4A) ; port CTRLA_SUPP.Temperature
CTRLA_HK_TEMP: CTRLA_U3.5(S2A) ; sheet Temperature-Sensor/OUT
CTRLA_HK_VBAT_CURR: CTRLA_U2.4(S1A) ; harness HK.Current
CTRLA_HK_VBAT_VOLT: CTRLA_U2.5(S2A) ; harness HK.Voltage
CTRLA_JTAG_~{RESET}: CTRLA_C4.1 CTRLA_H2.6 CTRLA_R23.1 U4.20(~{RESET})
CTRLA_JTAG_TCK: CTRLA_H2.1 CTRLA_R22.5 U4.57(PF4_(ADC4/TCK))
CTRLA_JTAG_TDI: CTRLA_H2.7 CTRLA_R22.8 U4.54(PF7_(ADC7/TDI))
CTRLA_JTAG_TDO: CTRLA_H2.3 CTRLA_R22.6 U4.55(PF6_(ADC6/TDO))
CTRLA_JTAG_TMS: CTRLA_H2.5 CTRLA_R22.7 U4.56(PF5_(ADC5/TMS))
CTRLA_LCLs_ANTs_FlagB: CTRLA_R12.2 U4.46(PA5_(AD5)) ; harness LCL-FPF_CTRL.LCL_FlagB
CTRLA_LCLs_ANTs_ON: U4.40(PC5_(A13)) ; harness LCL-FPF_CTRL.LCL_ON
CTRLA_LCLs_CAMnadir_FlagB: CTRLA_R8.2 U4.49(PA2_(AD2)) ; harness LCL-FPF_CTRL.LCL_FlagB
CTRLA_LCLs_CAMnadir_ON: U4.37(PC2_(A10)) ; harness LCL-FPF_CTRL.LCL_ON
CTRLA_LCLs_CAMwing_FlagB: CTRLA_R9.2 U4.48(PA3_(AD3)) ; harness LCL-FPF_CTRL.LCL_FlagB
CTRLA_LCLs_CAMwing_ON: U4.38(PC3_(A11)) ; harness LCL-FPF_CTRL.LCL_ON
CTRLA_LCLs_SENS_FlagB: CTRLA_R10.2 U4.47(PA4_(AD4)) ; harness LCL-FPF_CTRL.LCL_FlagB
CTRLA_LCLs_SENS_ON: U4.39(PC4_(A12)) ; harness LCL-FPF_CTRL.LCL_ON
CTRLA_LCLs_Suns_FlagB: CTRLA_R5.2 U4.50(PA1_(AD1)) ; harness LCL-FPF_CTRL.LCL_FlagB
CTRLA_LCLs_SunS_ON: U4.36(PC1_(A9)) ; harness LCL-FPF_CTRL.LCL_ON
CTRLA_LCLs_TKmain_FlagB: CTRLA_R2.2 U4.51(PA0_(AD0)) ; harness LCL-TK_CTRL.FlagB
CTRLA_LCLs_TKmain_ON: U4.35(PC0_(A8)) ; harness LCL-TK_CTRL.LCL_ON
CTRLA_MPPTX_~{CS}_ADC: CTRLA_R1.8 U4.6(PE4_(OC3B/INT4))
CTRLA_MPPTX_~{CS}_DAC: CTRLA_R1.7 U4.43(PG2_(ALE))
CTRLA_MPPTY+_~{CS}_ADC: CTRLA_R11.7 U4.27(PD2_(RXD1/INT2))
CTRLA_MPPTY+_~{CS}_DAC: CTRLA_R11.5 U4.28(PD3_(TXD1/INT3))
CTRLA_MPPTY-_~{CS}_ADC: CTRLA_R24.7 U4.31(PD6_(T1))
CTRLA_MPPTY-_~{CS}_DAC: CTRLA_R24.8 U4.32(PD7_(T2))
CTRLA_SPI_MISO: CTRLA_R1.5 CTRLA_R11.8 CTRLA_R16.6 CTRLA_R24.6 U4.13(PB3_(MISO))
CTRLA_SPI_MOSI: CTRLA_R1.6 CTRLA_R11.6 CTRLA_R16.5 CTRLA_R24.5 U4.12(PB2_(MOSI))
CTRLA_SPI_SCK: CTRLA_R3.1 U4.11(PB1_(SCK))
MPPT_3V3a: CTRLA_J1.1 ; port MPPTX.Supply
MPPT_3V3a: CTRLA_J2.1 ; port MPPTY+.Supply  [a separate net that carries the same name]
MPPT_3V3a: CTRLA_J4.1 ; port MPPTY-.Supply  [a separate net that carries the same name]
MPPT_CS_ADC: CTRLA_R1.1 ; port MPPTX.~{CS}_ADC
MPPT_CS_ADC: CTRLA_R11.2 ; port MPPTY+.~{CS}_ADC  [a separate net that carries the same name]
MPPT_CS_ADC: CTRLA_R24.2 ; port MPPTY-.~{CS}_ADC  [a separate net that carries the same name]
MPPT_CS_DAC: CTRLA_R1.2 ; port MPPTX.~{CS}_DAC
MPPT_CS_DAC: CTRLA_R11.4 ; port MPPTY+.~{CS}_DAC  [a separate net that carries the same name]
MPPT_CS_DAC: CTRLA_R24.1 ; port MPPTY-.~{CS}_DAC  [a separate net that carries the same name]
MPPT_DIN: CTRLA_R1.3 ; port MPPTX.DIN
MPPT_DIN: CTRLA_R11.3 ; port MPPTY+.DIN  [a separate net that carries the same name]
MPPT_DIN: CTRLA_R24.4 ; port MPPTY-.DIN  [a separate net that carries the same name]
MPPT_DOUT: CTRLA_R1.4 ; port MPPTX.DOUT
MPPT_DOUT: CTRLA_R11.1 ; port MPPTY+.DOUT  [a separate net that carries the same name]
MPPT_DOUT: CTRLA_R24.3 ; port MPPTY-.DOUT  [a separate net that carries the same name]
MPPT_SCLK: CTRLA_R4.2 ; port MPPTX.SCLK
MPPT_SCLK: CTRLA_R13.2 ; port MPPTY+.SCLK  [a separate net that carries the same name]
MPPT_SCLK: CTRLA_R25.2 ; port MPPTY-.SCLK  [a separate net that carries the same name]
NetCTRL_C3_1_1: U4.64(AVCC) ; sheet CTRL-A_Supply/CTRL_AVCC
NetCTRL_C5_1_1: U4.62(AREF) ; sheet CTRL-A_Supply/CTRL_AREF
NetCTRLA_C2_1: CTRLA_C2.1 CTRLA_R14.1 CTRLA_R15.2 CTRLA_U3.6(S3A)
NetCTRLA_H1_1: CTRLA_H1.1 CTRLA_R18.2
NetCTRLA_H1_3: CTRLA_H1.3 CTRLA_R19.2
NetCTRLA_J3_1: CTRLA_J3.1 ; harness BP_TemperatureSensors.VCC
NetCTRLA_R3_2: CTRLA_R3.2 CTRLA_R6.2 CTRLA_U1.2(A)
NetCTRLA_R4_1: CTRLA_R4.1 CTRLA_R7.2 CTRLA_R13.1 CTRLA_R17.1 CTRLA_R25.1 CTRLA_U1.4(Y)
NetCTRLA_R16_1: CTRLA_R16.1 ; harness BP_TemperatureSensors.~{CS}1
NetCTRLA_R16_2: CTRLA_R16.2 ; harness BP_TemperatureSensors.~{CS}2
NetCTRLA_R16_3: CTRLA_R16.3 ; harness BP_TemperatureSensors.MISO
NetCTRLA_R16_4: CTRLA_R16.4 ; harness BP_TemperatureSensors.MOSI
NetCTRLA_R17_2: CTRLA_R17.2 ; harness BP_TemperatureSensors.SCK
NetCTRLA_R18_1: CTRLA_R18.1 U4.3(PE1_(TXD0/PDO))
NetCTRLA_R19_1: CTRLA_R19.1 CTRLA_R26.1 U4.2(PE0_(RXD0/PDI))
NetCTRLA_R21_1: CTRLA_R21.1 ; sheet Temperature-Sensor/Vcc
NetCTRLA_U2_1: CTRLA_U2.1(A0) CTRLA_U3.1(A0) U4.8(PE6_(T3/INT6))
NetCTRLA_U2_8: CTRLA_U2.8(DA) U4.61(PF0_(ADC0))
NetCTRLA_U2_9: CTRLA_U2.9(DB) U4.60(PF1_(ADC1))
NetCTRLA_U2_16: CTRLA_U2.16(A1) CTRLA_U3.16(A1) U4.9(PE7_(IC3/INT7))
NetCTRLA_U3_8: CTRLA_U3.8(DA) U4.59(PF2_(ADC2))
NetCTRLA_U3_9: CTRLA_U3.9(DB) U4.58(PF3_(ADC3))
NetRPT_R3_1_2: U4.25(PD0_(SCL/INT0)) ; sheet I2C Repeater/I2C_Secondary.SCL
NetRPT_R5_1_2: U4.26(PD1_(SDA/INT1)) ; sheet I2C Repeater/I2C_Secondary.SDA
NetSEL_R4_1: U4.14(PB4_(OC0)) ; port DCDC_CTRLA.~{isLowBattery}
NetSEL_R6_2: U4.15(PB5_(OC1A)) ; port DCDC_CTRLA.~{PowerCycle}
NetSUPP_R13_1_2: U4.17(PB7_(OC2/OC1C)) ; port CTRLA_SUPP.WatchDog-Timer

Not connected (* = marked no-connect by the designer): CTRLA_U3 4(S1A)*; U4 1(~{PEN})* 4(PE2_(XCK0/AIN0))* 5(PE3_(OC3A/AIN1))* 7(PE5_(OC3C/INT5))* 10(PB0_(~{SS}))* 16(PB6_(OC1B))* 18(TOSC2/PG3)* 19(TOSC1/1PG4)* 23(XTAL2)* 24(XTAL1)* 44(PA7_(AD7))* 45(PA6_(AD6))*

### Buses and harness runs
harness port I2C_Bus = sheet I2C Repeater/I2C_Primary

### Notes on the sheet
- (near CTRLA_R6) 22k
- (near CTRLA_R7) 22k
- 22k
- CTRLA_LCLs_iMTQ_ON
- (near U4) 1MHz
- Title:
- Project:
- Author:
- Model:
- Document Number:
- Checked by:
- Rev:
- Date:
- Approved by:
- Sheet:
- of
- File name:

### Library data of the parts
CTRLA_C1-CTRLA_C5 = Cer_C0603T104K5RALTU: Ceramic Cap Kemet COTS 100n/50V X7R 0603; Manufacturer: Kemet; ManufacturerPartNumber: C0603T104K5RALTU
  CTRLA_C1-CTRLA_C3 CTRLA_C5: Value: 100n/50V
  CTRLA_C4: Value: 10n/50V
CTRLA_H1 = Header 2X2: Header, 2-Pin, Dual row; LatestRevisionDate: 17-Jul-2002; LatestRevisionNote: Re-released for DXP Platform.; Publisher: Altium Limited
CTRLA_H2 = Header 4X2: Header, 4-Pin, Dual row; LatestRevisionDate: 17-Jul-2002; LatestRevisionNote: Re-released for DXP Platform.; Publisher: Altium Limited
CTRLA_J1-CTRLA_J4 = 2way: ComponentLink1URL: http://www.edatools.cz/addons; ComponentLink1Description: Source; FootprintNote: LP=12mil, MP=40mil, HP=120mil
CTRLA_R1 CTRLA_R11 CTRLA_R16 CTRLA_R22 CTRLA_R24 = YC124-JR-072K2L: RESISTOR ARRAY, 4 x 0402; URL: http://pl.farnell.com/yageo-phycomp/yc124-jr-072k2l/resistor-array-arv341-4-x-0402/dp/9235388
CTRLA_R2-CTRLA_R10 CTRLA_R12-CTRLA_R15 CTRLA_R17-CTRLA_R19 CTRLA_R23 CTRLA_R25 CTRLA_R26 = CRCW06034K70FKxxxx: 4.7k/1% Vishay CRCW 0603 Resistor. 100mW, 100ppm, 75V.; Manufacturer: Vishay; ManufactuerPartNumber: CRCW06034K70FKxxxx
  CTRLA_R2 CTRLA_R5 CTRLA_R8-CTRLA_R10 CTRLA_R12: Value: 220k
  CTRLA_R3 CTRLA_R4 CTRLA_R13 CTRLA_R17 CTRLA_R25: Value: 33R
  CTRLA_R6 CTRLA_R7: Value: 4.7k
  CTRLA_R14 CTRLA_R15: Value: 10k/1%
  CTRLA_R18 CTRLA_R19: Value: 220R/1%
  CTRLA_R23: Value: 4.7k/1%
  CTRLA_R26: Value: 3.3k/1%
CTRLA_R21 = CRCW06031K00FKxxxx: 1k/1% Vishay CRCW 0603 Resistor. 100mW, 100ppm, 75V.; Manufacturer: Vishay; ManufacturerPartNumber: CRCW06031K00FKxxxx; Value: 100R/1%
CTRLA_U1 = NC7SZ14: TinyLogic UHS TinyLogic UHS Two-Input NAND Gate.; Manufacturer: Fairchild Semiconductor; Value: NC7SZ14
CTRLA_U2 CTRLA_U3 = ADG709: CMOS Analog 4-Channel Multiplexer; Manufacturer: Analog Devices; ManufacturerPartNumber: ADG709
U4 = ATmega128L-8Ax: 128K Bytes of In-System Programmable Flash Memory; Manufacturer: Atmel; ManufacturerPartNumber: ATmega128L-8Ax; Value: ATmega128L-8Ax

## Sheet EPS_I2C-Repeater.SchDoc: I2C Repeater
size A4; ApprovedBy: (not approved); CheckedBy: (not checked); Author: Piotr Kuligowski; DocumentNumber: PWSat2-xxx-DW-xxx; Revision: 3; SheetNumber: 15; SheetTotal: 51; Model: FPM
Used 2 times, as channels Top/Controller A/I2C Repeater, Top/Controller B/I2C Repeater. Parts and nets are listed once, with the designators drawn on the sheet.
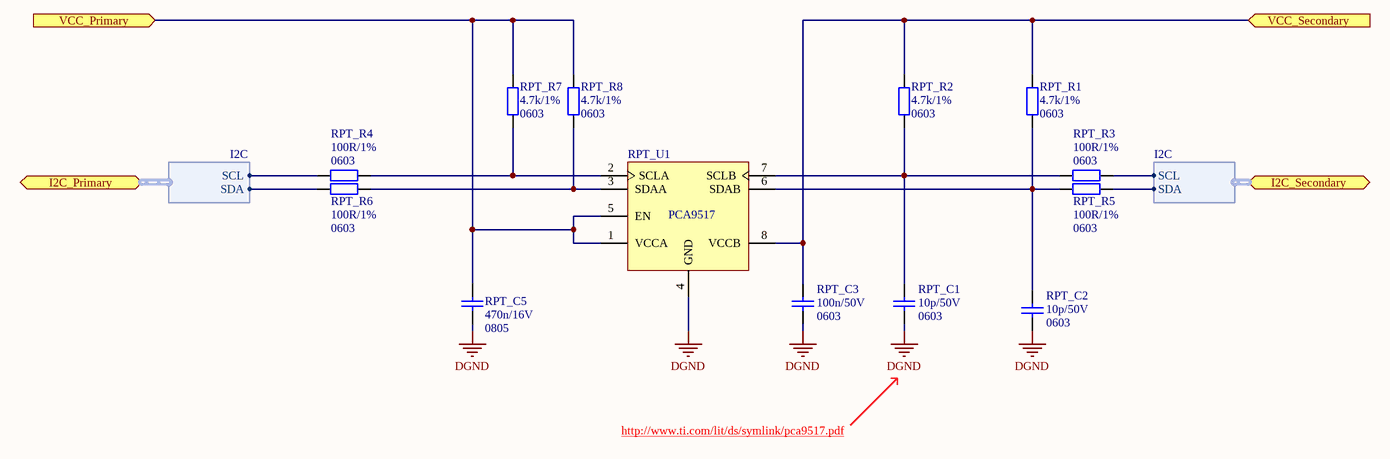
[diagram p3: EPS_I2C-Repeater.SchDoc]

### Parts
RPT_C1  Package: 0603  [SMD_Capacitor_0603]  (hidden comment: 10p/50V)
RPT_C2  Package: 0603  [SMD_Capacitor_0603]  (hidden comment: 10p/50V)
RPT_C3  Package: 0603  [SMD_Capacitor_0603]  (hidden comment: 100n/50V)
RPT_C5  value 470n/16V  Package: 0805  [SMD_Capacitor_0805]  (hidden comment: Cap)
RPT_R1  Package: 0603  [SMD_Resistor_0603]  (hidden comment: 4.7k/1%)
RPT_R2  Package: 0603  [SMD_Resistor_0603]  (hidden comment: 4.7k/1%)
RPT_R3  Package: 0603  [SMD_Resistor_0603]  (hidden comment: 100R/1%)
RPT_R4  Package: 0603  [SMD_Resistor_0603]  (hidden comment: 100R/1%)
RPT_R5  Package: 0603  [SMD_Resistor_0603]  (hidden comment: 100R/1%)
RPT_R6  Package: 0603  [SMD_Resistor_0603]  (hidden comment: 100R/1%)
RPT_R7  Package: 0603  [SMD_Resistor_0603]  (hidden comment: 4.7k/1%)
RPT_R8  Package: 0603  [SMD_Resistor_0603]  (hidden comment: 4.7k/1%)
RPT_U1  PCA9517  [TSSOP8_L]

### Ports
I2C_Primary (harness I2C), I2C_Secondary (harness I2C), VCC_Primary (in), VCC_Secondary (in)

### Harnesses
I2C: SDA, SCL

### Nets
DGND: RPT_C1.2 RPT_C2.2 RPT_C3.1 RPT_C5.2 RPT_U1.4(GND)
VCC_Primary: RPT_C5.1 RPT_R7.2 RPT_R8.1 RPT_U1.1(VCCA) RPT_U1.5(EN) ; port VCC_Primary
VCC_Secondary: RPT_C3.2 RPT_R1.1 RPT_R2.1 RPT_U1.8(VCCB) ; port VCC_Secondary
NetRPT_C1_1: RPT_C1.1 RPT_R2.2 RPT_R3.1 RPT_U1.7(SCLB)
NetRPT_C2_1: RPT_C2.1 RPT_R1.2 RPT_R5.1 RPT_U1.6(SDAB)
NetRPT_R3_2: RPT_R3.2 ; port I2C_Secondary.SCL
NetRPT_R4_1: RPT_R4.1 RPT_R7.1 RPT_U1.2(SCLA)
NetRPT_R4_2: RPT_R4.2 ; port I2C_Primary.SCL
NetRPT_R5_2: RPT_R5.2 ; port I2C_Secondary.SDA
NetRPT_R6_1: RPT_R6.1 RPT_R8.2 RPT_U1.3(SDAA)
NetRPT_R6_2: RPT_R6.2 ; port I2C_Primary.SDA

### Channels
Top/Controller A/I2C Repeater: designators end in _1; ports VCC_Primary=CTRLA_3V3d VCC_Secondary=CTRLA_3V3d
Top/Controller B/I2C Repeater: designators end in _2; ports VCC_Primary=CTRLB_3V3d VCC_Secondary=CTRLB_3V3d

### Notes on the sheet
- http://www.ti.com/lit/ds/symlink/pca9517.pdf
- Title:
- Project:
- Author:
- Model:
- Document Number:
- Checked by:
- Rev:
- Date:
- Approved by:
- Sheet:
- of
- File name:

### Library data of the parts
RPT_C1 RPT_C2 = Cer_GCM1885C1H100JA16D: Ceramic Cap Murata Automotive 10p/50V C0G 0603; Manufacturer: Murata; ManufacturerPartNumber: GCM1885C1H100JA16D; Value: 10p/50V
RPT_C3 = Cer_C0603T104K5RALTU: Ceramic Cap Kemet COTS 100n/50V X7R 0603; Manufacturer: Kemet; ManufacturerPartNumber: C0603T104K5RALTU; Value: 100n/50V
RPT_R1 RPT_R2 RPT_R7 RPT_R8 = CRCW06034K70FKxxxx: as CTRLA_R2 on sheet EPS_CTRL_A; Manufacturer: Vishay; ManufactuerPartNumber: CRCW06034K70FKxxxx; Value: 4.7k/1%
RPT_R3-RPT_R6 = CRCW0603100RFKxxxx: 100R/1% Vishay CRCW 0603 Resistor. 100mW, 100ppm, 75V.; Manufacturer: Vishay; ManufacturerPartNumber: CRCW0603100RFKxxxx; Value: 100R/1%
RPT_U1 = PCA9517: Level-Translating I2C Bus Repeater; Manufacturer: Texas Instruments; ManufacturerPartNumber: PCA9517

## Sheet EPS_CTRL_AB_Supply.SchDoc: CTRL-A and CTRL-B / Supply
size A4; ApprovedBy: (not approved); CheckedBy: (not checked); Author: Piotr Kuligowski; DocumentNumber: PWSat2-xxx-DW-xxx; Revision: 3; SheetNumber: 16; SheetTotal: 51; Model: FPM
Used 2 times, as channels Top/Controller A/CTRL-A_Supply, Top/Controller B/CTRL-B_Supply. Parts and nets are listed once, with the designators drawn on the sheet.
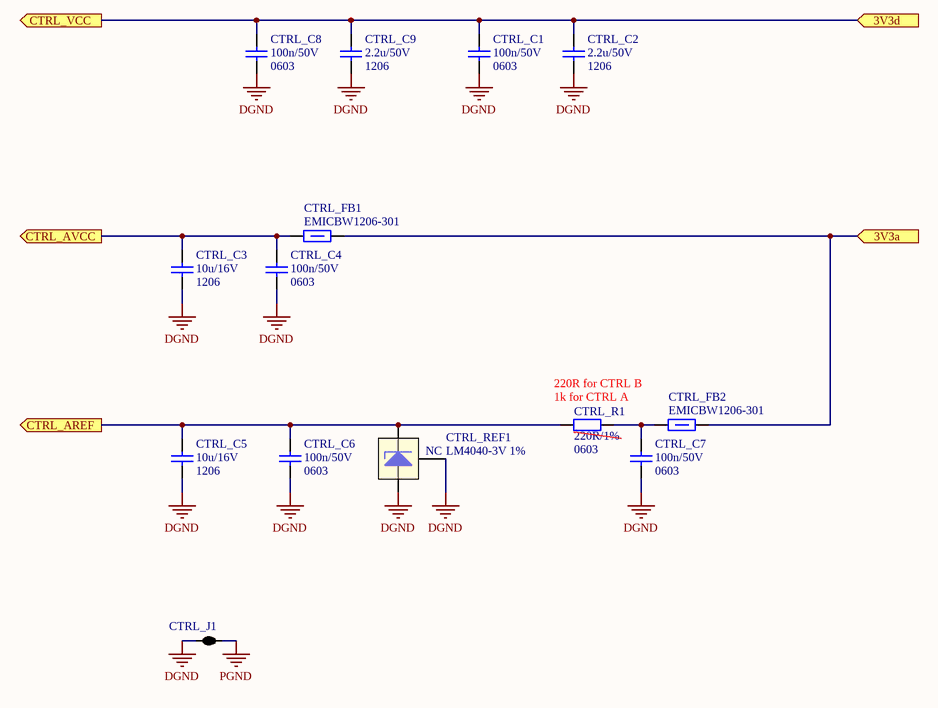
[diagram p4: EPS_CTRL_AB_Supply.SchDoc]

### Parts
CTRL_C1  Package: 0603  [SMD_Capacitor_0603]  (hidden comment: 100n/50V)
CTRL_C2  Package: 1206  [SMD_Capacitor_1206]  (hidden comment: 2.2u/50V)
CTRL_C3  Packge: 1206  [SMD_Capacitor_1206]  (hidden comment: 10u/16V)
CTRL_C4  Package: 0603  [SMD_Capacitor_0603]  (hidden comment: 100n/50V)
CTRL_C5  Packge: 1206  [SMD_Capacitor_1206]  (hidden comment: 10u/16V)
CTRL_C6  Package: 0603  [SMD_Capacitor_0603]  (hidden comment: 100n/50V)
CTRL_C7  Package: 0603  [SMD_Capacitor_0603]  (hidden comment: 100n/50V)
CTRL_C8  Package: 0603  [SMD_Capacitor_0603]  (hidden comment: 100n/50V)
CTRL_C9  Package: 1206  [SMD_Capacitor_1206]  (hidden comment: 2.2u/50V)
CTRL_FB1  ManufacturerPartNumber: EMICBW1206-301  [1206]  (hidden comment: *)
CTRL_FB2  ManufacturerPartNumber: EMICBW1206-301  [1206]  (hidden comment: *)
CTRL_J1  2 way net tie junction  [2way_LP]  (value not drawn)  (net tie, no BOM)
CTRL_R1  Package: 0603  [SMD_Resistor_0603]  (hidden comment: 220R/1%)
CTRL_REF1  LM4040-3V 1%  [SOT23-3]

### Ports
3V3a (in), 3V3d (in), CTRL_AREF (out), CTRL_AVCC (out), CTRL_VCC (out)

### Nets
DGND: CTRL_C1.2 CTRL_C2.2 CTRL_C3.2 CTRL_C4.2 CTRL_C5.2 CTRL_C6.2 CTRL_C7.2 CTRL_C8.2 CTRL_C9.2 CTRL_J1.2 CTRL_REF1.2(A) CTRL_REF1.3(NC)
PGND: CTRL_J1.1
3V3a: CTRL_FB1.1 CTRL_FB2.1 ; port 3V3a
3V3d: CTRL_C1.1 CTRL_C2.1 CTRL_C8.1 CTRL_C9.1 ; port CTRL_VCC, port 3V3d
CTRL_AREF: CTRL_C5.1 CTRL_C6.1 CTRL_R1.1 CTRL_REF1.1(K) ; port CTRL_AREF
CTRL_AVCC: CTRL_C3.1 CTRL_C4.1 CTRL_FB1.2 ; port CTRL_AVCC
NetCTRL_C7_1: CTRL_C7.1 CTRL_FB2.2 CTRL_R1.2

### Channels
Top/Controller A/CTRL-A_Supply: designators end in _1; ports 3V3a=CTRLA_3V3a 3V3d=CTRLA_3V3d CTRL_AREF=NetCTRL_C5_1_1 CTRL_AVCC=NetCTRL_C3_1_1 CTRL_VCC=CTRLA_3V3d
Top/Controller B/CTRL-B_Supply: designators end in _2; ports 3V3a=CTRLB_3V3a 3V3d=CTRLB_3V3d CTRL_AREF=CTRLB_Vref CTRL_AVCC=NetCTRL_C3_2_1 CTRL_VCC=CTRLB_3V3d

### Notes on the sheet
- 220R for CTRL B
- (near CTRL_R1) 1k for CTRL A
- Title:
- Project:
- Author:
- Model:
- Document Number:
- Checked by:
- Rev:
- Date:
- Approved by:
- Sheet:
- of
- File name:

### Library data of the parts
CTRL_C1 CTRL_C4 CTRL_C6-CTRL_C8 = Cer_C0603T104K5RALTU: Ceramic Cap Kemet COTS 100n/50V X7R 0603; Manufacturer: Kemet; ManufacturerPartNumber: C0603T104K5RALTU; Value: 100n/50V
CTRL_C2 CTRL_C9 = Cer_GCJ31CR71H225KA12L: Ceramic Cap Murata Automotive 2.2u/50V X7R 1206; Manufacturer: Murata; ManufacturerPartNumber: GCJ31CR71H225KA12L; Value: 2.2u/50V
CTRL_C3 CTRL_C5 = Cer_C1206T106K4RACTU: Ceramic Cap Kemet COTS 10u/16V X7R 1206; ManufacturerPartNumber: C1206T106K4RACTU; Manufacturer: Kemet; Value: 10u/16V
CTRL_FB1 CTRL_FB2 = FerriteBead: Ferrite Bead; Manufacturer: Fengua; HelpUrl: *; Supplier 1: *; Value: *
CTRL_J1 = 2way: ComponentLink1URL: http://www.edatools.cz/addons; ComponentLink1Description: Source; FootprintNote: LP=12mil, MP=40mil, HP=120mil
CTRL_R1 = Res: Value: 220R/1%
CTRL_REF1 = LM4040DIM3-3.0: Shunt V-REF, 3V, 1%, SOT23-3; Manufacturer: Texas Instruments; ManufacturerPartNumber: LM4040DIM3-3.0; HelpUrl: http://www.ti.com/lit/ds/symlink/lm4040-n.pdf; Value: LM4040-3V 1%

## Sheet EPS_Temperature-Sensor.SchDoc: Temperature Sensor
size A4; ApprovedBy: (not approved); CheckedBy: (not checked); Author: P. Kuligowski; DocumentNumber: PWSat2-xxx-DW-xxx; Revision: 3; SheetNumber: 14; SheetTotal: 51; Model: FPM
Used 7 times, as channels Top/Controller A/Temperature-Sensor, Top/3V3/Temperature-Sensor, Top/5V/Temperature-Sensor, Top/Local-Supply and WDTs/Local-Supply CTRL-A/Temperature-Sensor, Top/Local-Supply and WDTs/Local-Supply CTRL-B/Temperature-Sensor, Top/Battery Pack/Temperature-Sensor, Top/Controller B/Temperature-Sensor. Parts and nets are listed once, with the designators drawn on the sheet.
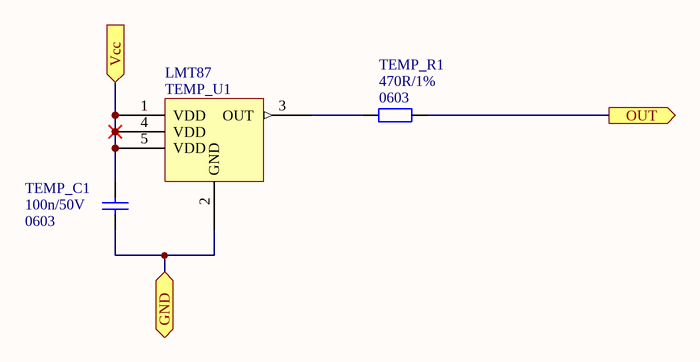
[diagram p5: EPS_Temperature-Sensor.SchDoc]

### Parts
TEMP_C1  Package: 0603  [SMD_Capacitor_0603]  (hidden comment: 100n/50V)
TEMP_R1  Package: 0603  [SMD_Resistor_0603]  (hidden comment: 470R/1%)
TEMP_U1  LMT87  [SC70-LT5_N]

### Ports
GND, OUT (out), Vcc (in)

### Nets
GND: TEMP_C1.2 TEMP_U1.2(GND) ; port GND
OUT: TEMP_R1.2 ; port OUT
Vcc: TEMP_C1.1 TEMP_U1.1(VDD) TEMP_U1.4(VDD) TEMP_U1.5(VDD) ; port Vcc
NetTEMP_R1_1: TEMP_R1.1 TEMP_U1.3(OUT)

### Channels
Top/Controller A/Temperature-Sensor: designators end in _1; ports GND=DGND OUT=CTRLA_HK_TEMP Vcc=NetCTRLA_R21_1
Top/3V3/Temperature-Sensor: designators end in _2; ports GND=PGND OUT=CTRLA_HK_3V3_TEMP Vcc=NetTEMP_C1_2_1
Top/5V/Temperature-Sensor: designators end in _3; ports GND=PGND OUT=CTRLA_HK_5V_TEMP Vcc=NetTEMP_C1_3_1
Top/Local-Supply and WDTs/Local-Supply CTRL-A/Temperature-Sensor: designators end in _4; ports GND=PGND OUT=CTRLA_HK_SUPP_TEMP Vcc=NetTEMP_C1_4_1
Top/Local-Supply and WDTs/Local-Supply CTRL-B/Temperature-Sensor: designators end in _5; ports GND=PGND OUT=CTRLB_HK_SUPP_TEMP Vcc=NetTEMP_C1_5_1
Top/Battery Pack/Temperature-Sensor: designators end in _6; ports GND=PGND OUT=CTRLA_BATC_TEMP Vcc=NetTEMP_C1_6_1
Top/Controller B/Temperature-Sensor: designators end in _7; ports GND=DGND OUT=CTRLB_HK_TEMP Vcc=NetCTRLB_R10_1

### Notes on the sheet
- Title:
- Project:
- Author:
- Model:
- Document Number:
- Checked by:
- Rev:
- Date:
- Approved by:
- Sheet:
- of
- File name:

### Library data of the parts
TEMP_C1 = Cer_C0603T104K5RALTU: Ceramic Cap Kemet COTS 100n/50V X7R 0603; Manufacturer: Kemet; ManufacturerPartNumber: C0603T104K5RALTU; Value: 100n/50V
TEMP_R1 = CRCW06031K00FKxxxx: as CTRLA_R21 on sheet EPS_CTRL_A; Manufacturer: Vishay; ManufacturerPartNumber: CRCW06031K00FKxxxx; Value: 470R/1%
TEMP_U1 = LMT87: Analog Temperature Sensors with Class-AB Output

## Sheet EPS_MPPT_X.SchDoc: MPPT-X
size A3; ApprovedBy: (not approved); CheckedBy: (not checked); Author: Piotr Kuligowski; DocumentNumber: PWSat2-xxx-DW-xxx; Revision: 3; SheetNumber: 4; SheetTotal: 51; Model: FPM
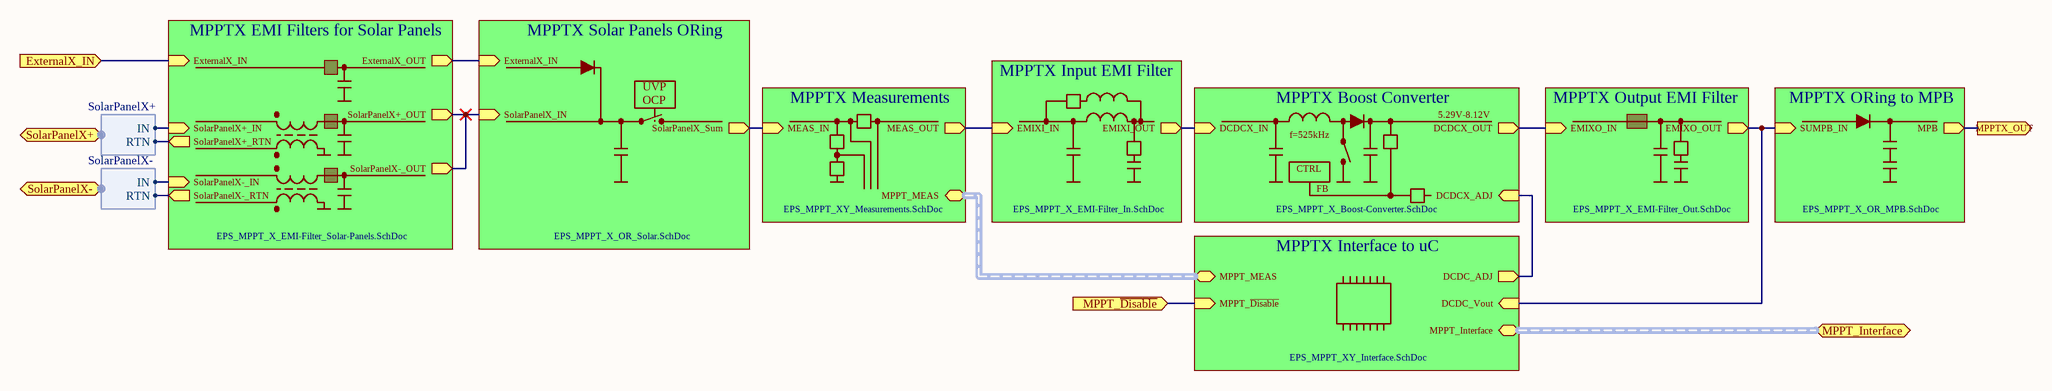
[diagram p6: EPS_MPPT_X.SchDoc]

### Sub-sheets
MPPTX Boost Converter = EPS_MPPT_X_Boost-Converter.SchDoc: DCDCX_IN (in), DCDCX_OUT (out), DCDCX_ADJ (in)
MPPTX EMI Filters for Solar Panels = EPS_MPPT_X_EMI-Filter_Solar-Panels.SchDoc (file not in this document): SolarPanelX+_RTN (out), SolarPanelX-_IN (in), ExternalX_IN (in), SolarPanelX-_RTN (out), SolarPanelX+_IN (in), ExternalX_OUT (out), SolarPanelX-_OUT (out), SolarPanelX+_OUT (out)
MPPTX Input EMI Filter = EPS_MPPT_X_EMI-Filter_In.SchDoc: EMIXI_OUT (out), EMIXI_IN (in)
MPPTX Interface to uC = EPS_MPPT_XY_Interface.SchDoc: MPPT_Interface (harness MPPT_Interface), DCDC_Vout (in), MPPT_MEAS (harness MPPT_MEAS), DCDC_ADJ (out), MPPT_~{Disable} (in)
MPPTX Measurements = EPS_MPPT_XY_Measurements.SchDoc: MEAS_IN (in), MEAS_OUT (out), MPPT_MEAS (harness MPPT_MEAS)
MPPTX ORing to MPB = EPS_MPPT_X_OR_MPB.SchDoc: MPB (out), SUMPB_IN (in)
MPPTX Output EMI Filter = EPS_MPPT_X_EMI-Filter_Out.SchDoc (file not in this document): EMIXO_OUT (out), EMIXO_IN (in)
MPPTX Solar Panels ORing = EPS_MPPT_X_OR_Solar.SchDoc (file not in this document): ExternalX_IN (in), SolarPanelX_Sum (out), SolarPanelX_IN (in)

### Ports
ExternalX_IN (in), MPPT_Interface (harness MPPT_Interface), MPPT_~{Disable} (in), MPPTX_OUT (out), SolarPanelX+ (harness SolarPanelX+), SolarPanelX- (harness SolarPanelX-)

### Harnesses
SolarPanelX+: IN, RTN
SolarPanelX-: IN, RTN

### Nets
PC-104_EXTX: port ExternalX_IN, sheet MPPTX EMI Filters for Solar Panels/ExternalX_IN
PC-104_Kill-Switch_Pri: port MPPTX_OUT, sheet MPPTX ORing to MPB/MPB
NetCTRLB_U1_1: port MPPT_~{Disable}, sheet MPPTX Interface to uC/MPPT_~{Disable}
NetDCDCX_C1_2: sheet MPPTX Boost Converter/DCDCX_IN, sheet MPPTX Input EMI Filter/EMIXI_OUT
NetDCDCX_C2_2: sheet MPPTX Boost Converter/DCDCX_OUT, sheet MPPTX Output EMI Filter/EMIXO_IN
NetDCDCX_R7_2: sheet MPPTX Boost Converter/DCDCX_ADJ, sheet MPPTX Interface to uC/DCDC_ADJ
NetEMIXI_C1_1: sheet MPPTX Measurements/MEAS_OUT, sheet MPPTX Input EMI Filter/EMIXI_IN
NetH6_3: sheet MPPTX EMI Filters for Solar Panels/SolarPanelX+_IN, port SolarPanelX+.IN
NetH6_4: sheet MPPTX EMI Filters for Solar Panels/SolarPanelX+_RTN, port SolarPanelX+.RTN
NetH7_3: sheet MPPTX EMI Filters for Solar Panels/SolarPanelX-_IN, port SolarPanelX-.IN
NetH7_4: sheet MPPTX EMI Filters for Solar Panels/SolarPanelX-_RTN, port SolarPanelX-.RTN
NetMEAS_R1_1_1: sheet MPPTX Solar Panels ORing/SolarPanelX_Sum, sheet MPPTX Measurements/MEAS_IN
NetMPPT_R13_1_2: sheet MPPTX Interface to uC/DCDC_Vout, sheet MPPTX Output EMI Filter/EMIXO_OUT, sheet MPPTX ORing to MPB/SUMPB_IN
(unnamed): sheet MPPTX Solar Panels ORing/ExternalX_IN, sheet MPPTX EMI Filters for Solar Panels/ExternalX_OUT
(unnamed): sheet MPPTX Solar Panels ORing/SolarPanelX_IN, sheet MPPTX EMI Filters for Solar Panels/SolarPanelX-_OUT, sheet MPPTX EMI Filters for Solar Panels/SolarPanelX+_OUT

### Buses and harness runs
harness port MPPT_Interface = sheet MPPTX Interface to uC/MPPT_Interface
harness sheet MPPTX Interface to uC/MPPT_MEAS = sheet MPPTX Measurements/MPPT_MEAS

### Notes on the sheet
- UVP
- OCP
- f=525kHz
- CTRL
- 5.29V-8.12V
- FB
- Title:
- Project:
- Author:
- Model:
- Document Number:
- Checked by:
- Rev:
- Date:
- Approved by:
- Sheet:
- of
- File name:

## Sheet EPS_MPPT_X_Boost-Converter.SchDoc: MPPT-X / Boost-Converter
size A3; ApprovedBy: (not approved); CheckedBy: (not checked); Author: Piotr Kuligowski; DocumentNumber: PWSat2-xxx-DW-xxx; Revision: 3; SheetNumber: 9; SheetTotal: 51; Model: FPM
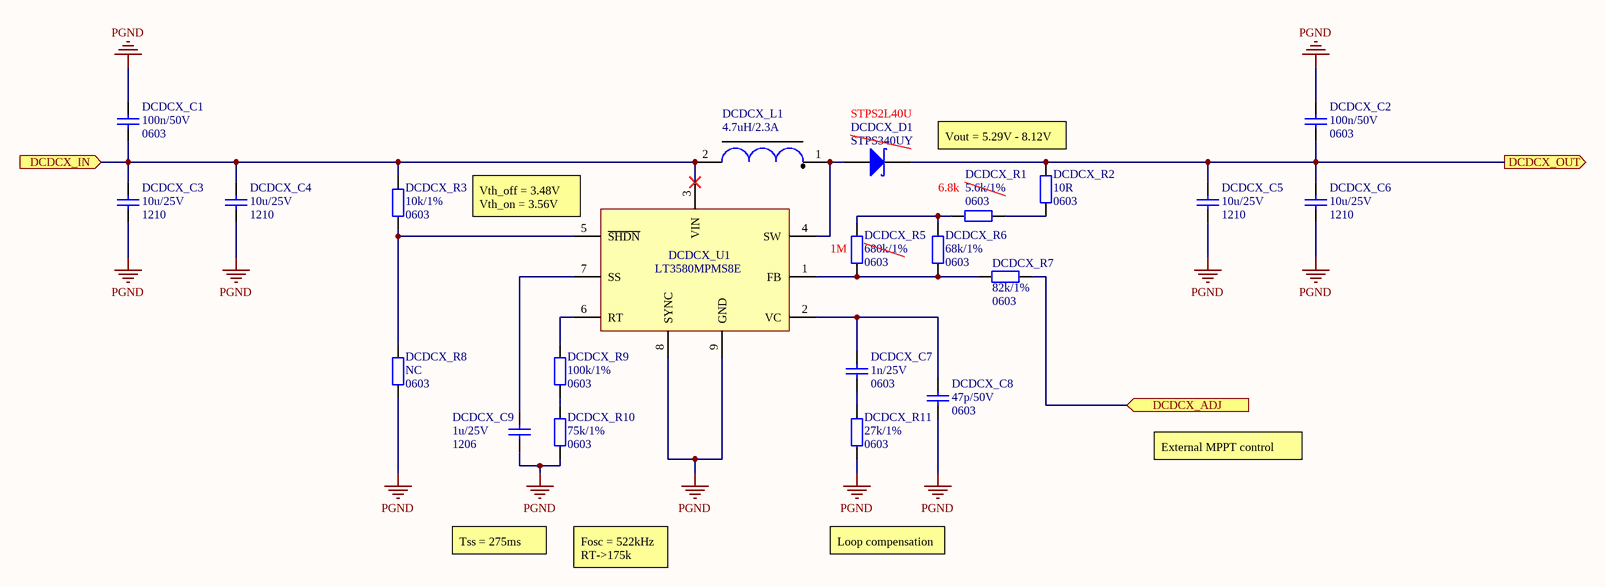
[diagram p7: EPS_MPPT_X_Boost-Converter.SchDoc]

### Parts
DCDCX_C1  Package: 0603  [SMD_Capacitor_0603]  (hidden comment: 100n/50V)
DCDCX_C2  Package: 0603  [SMD_Capacitor_0603]  (hidden comment: 100n/50V)
DCDCX_C3  Package: 1210  [SMD_Capacitor_1210]  (hidden comment: 10u/25V)
DCDCX_C4  Package: 1210  [SMD_Capacitor_1210]  (hidden comment: 10u/25V)
DCDCX_C5  Package: 1210  [SMD_Capacitor_1210]  (hidden comment: 10u/25V)
DCDCX_C6  Package: 1210  [SMD_Capacitor_1210]  (hidden comment: 10u/25V)
DCDCX_C7  value 1n/25V  Package: 0603  [SMD_Capacitor_0603]  (hidden comment: Cap)
DCDCX_C8  value 47p/50V  Package: 0603  [SMD_Capacitor_0603]  (hidden comment: Cap)
DCDCX_C9  Package: 1206  [SMD_Capacitor_1206]  (hidden comment: 1u/25V)
DCDCX_D1  STPS340UY  [DO-214AA]
DCDCX_L1  4.7uH/2.3A  [Coilcraft_MSS6132]
DCDCX_R1  Package: 0603  [SMD_Resistor_0603]  (hidden comment: 5.6k/1%)
DCDCX_R2  Package: 0603  [SMD_Resistor_0603]  (hidden comment: 10R)
DCDCX_R3  Package: 0603  [SMD_Resistor_0603]  (hidden comment: 10k/1%)
DCDCX_R5  Package: 0603  [SMD_Resistor_0603]  (hidden comment: 680k/1%)
DCDCX_R6  Package: 0603  [SMD_Resistor_0603]  (hidden comment: 68k/1%)
DCDCX_R7  Package: 0603  [SMD_Resistor_0603]  (hidden comment: 82k/1%)
DCDCX_R8  Package: 0603  [SMD_Resistor_0603]  (hidden comment: NC)
DCDCX_R9  Package: 0603  [SMD_Resistor_0603]  (hidden comment: 100k/1%)
DCDCX_R10  Package: 0603  [SMD_Resistor_0603]  (hidden comment: 75k/1%)
DCDCX_R11  Package: 0603  [SMD_Resistor_0603]  (hidden comment: 27k/1%)
DCDCX_U1  (no value)  [LT-MS8E-8-1880X1680TP_N]

### Ports
DCDCX_ADJ (in), DCDCX_IN (in), DCDCX_OUT (out)

### Nets
PGND: DCDCX_C1.1 DCDCX_C2.1 DCDCX_C3.2 DCDCX_C4.2 DCDCX_C5.2 DCDCX_C6.2 DCDCX_C8.2 DCDCX_C9.2 DCDCX_R8.2 DCDCX_R10.2 DCDCX_R11.2 DCDCX_U1.8(SYNC) DCDCX_U1.9(GND)
NetDCDCX_C1_2: DCDCX_C1.2 DCDCX_C3.1 DCDCX_C4.1 DCDCX_L1.2 DCDCX_R3.1 DCDCX_U1.3(VIN) ; port DCDCX_IN
NetDCDCX_C2_2: DCDCX_C2.2 DCDCX_C5.1 DCDCX_C6.1 DCDCX_D1.K DCDCX_R2.2 ; port DCDCX_OUT
NetDCDCX_C7_1: DCDCX_C7.1 DCDCX_C8.1 DCDCX_U1.2(VC)
NetDCDCX_C7_2: DCDCX_C7.2 DCDCX_R11.1
NetDCDCX_C9_1: DCDCX_C9.1 DCDCX_U1.7(SS)
NetDCDCX_D1_A: DCDCX_D1.A DCDCX_L1.1 DCDCX_U1.4(SW)
NetDCDCX_R1_1: DCDCX_R1.1 DCDCX_R5.1 DCDCX_R6.1
NetDCDCX_R1_2: DCDCX_R1.2 DCDCX_R2.1
NetDCDCX_R3_2: DCDCX_R3.2 DCDCX_R8.1 DCDCX_U1.5(~{SHDN})
NetDCDCX_R5_2: DCDCX_R5.2 DCDCX_R6.2 DCDCX_R7.1 DCDCX_U1.1(FB)
NetDCDCX_R7_2: DCDCX_R7.2 ; port DCDCX_ADJ
NetDCDCX_R9_1: DCDCX_R9.1 DCDCX_U1.6(RT)
NetDCDCX_R9_2: DCDCX_R9.2 DCDCX_R10.1

### Notes on the sheet
- STPS2L40U
- (near DCDCX_R2) Vout = 5.29V - 8.12V
- (near DCDCX_U1) Vth_off = 3.48V
  Vth_on = 3.56V
- (near DCDCX_R1) 6.8k
- (near DCDCX_R5) 1M
- External MPPT control
- Tss = 275ms
- Fosc = 522kHz
  RT->175k
- Loop compensation
- Title:
- Project:
- Author:
- Model:
- Document Number:
- Checked by:
- Rev:
- Date:
- Approved by:
- Sheet:
- of
- File name:

### Library data of the parts
DCDCX_C1 DCDCX_C2 = Cer_C0603T104K5RALTU: Ceramic Cap Kemet COTS 100n/50V X7R 0603; Manufacturer: Kemet; ManufacturerPartNumber: C0603T104K5RALTU; Value: 100n/50V
DCDCX_C3-DCDCX_C6 = Cer_GCJ32ER71E106KA12L: Ceramic Cap Murata Automotive 10u/25V X7R 1210; Manufacturer: Murata; ManufacturerPartNumber: GCJ32ER71E106KA12L; Value: 10u/25V
DCDCX_C9 = Cer_C1206T105K3RALTU: Ceramic Cap Kemet COTS 1u/25V X7R 1206; ManufacturerPartNumber: C1206T105K3RALTU; Manufacturer: Kemet; Value: 1u/25V
DCDCX_D1 = STPS340x: 3A/40V Power Schottky Rectifier.; Manufacturer: STMicroelectronics; Value: STPS340UY
DCDCX_L1 = MSS6132-472MLx: Coilcraft MSS6132 Inductor, L=4.7uH, Irise20deg=2.3A, ESR=43mR, SRF=65MHz.; Manufacturer: Coilcraft; ManufacturerPartNumber: MSS6132-472MLx; Value: 4.7uH/2.3A
DCDCX_R1-DCDCX_R3 DCDCX_R5-DCDCX_R11 = Res
  DCDCX_R1: Value: 5.6k/1%
  DCDCX_R2: Value: 10R
  DCDCX_R3: Value: 10k/1%
  DCDCX_R5: Value: 680k/1%
  DCDCX_R6: Value: 68k/1%
  DCDCX_R7: Value: 82k/1%
  DCDCX_R8: Value: NC
  DCDCX_R9: Value: 100k/1%
  DCDCX_R10: Value: 75k/1%
  DCDCX_R11: Value: 27k/1%
DCDCX_U1 = LT3580MPMS8E: Boost Conv 2A, Soft-Start, Synchro; Manufacturer: Linear Technology; ManufacturerPartNumber: LT3580MPMS8E; HelpUrl: http://cds.linear.com/docs/en/datasheet/3580fg.pdf